# EAGLE design elasticNode (EAGLE 8.4.2)

## Sheet 1 of 4
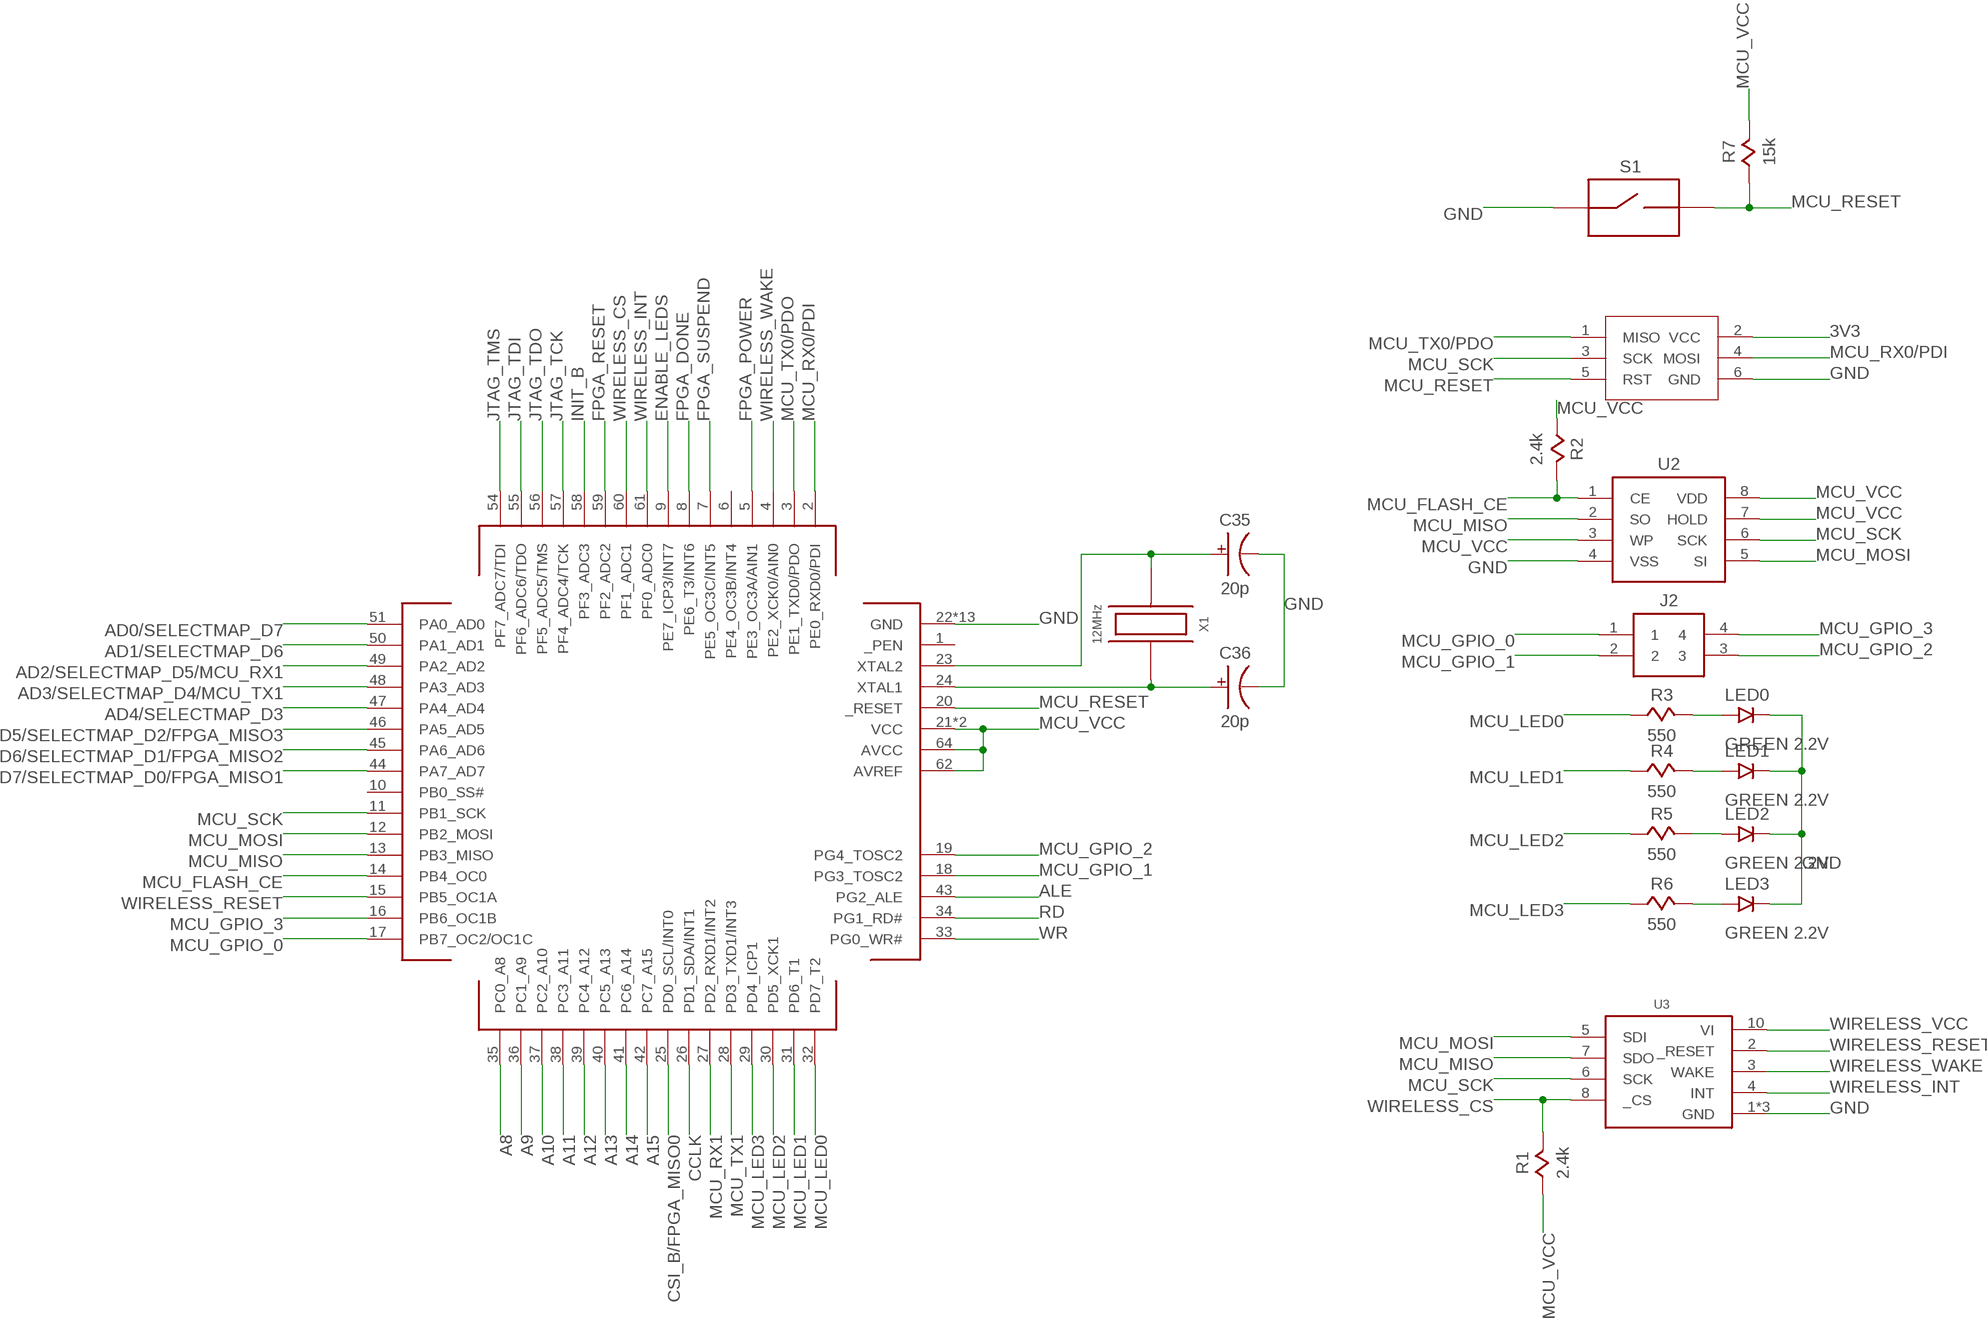
[diagram p0: schematic, sheet 1]

### Parts
C35  20p  CAPACITOR0805  [0805]
C36  20p  CAPACITOR0805  [0805]
J1  ISP_CONN_6PIN  [3X2_HEADER_SMT]
J2  FEMALE_HEADER_2X2  [2X2_HEADER]
LED0  GREEN 2.2V  LED  [0805]
LED1  GREEN 2.2V  LED  [0805]
LED2  GREEN 2.2V  LED  [0805]
LED3  GREEN 2.2V  LED  [0805]
R1  2.4k  RESISTOR  [0805]
R2  2.4k  RESISTOR  [0805]
R3  550  RESISTOR  [0805]
R4  550  RESISTOR  [0805]
R5  550  RESISTOR  [0805]
R6  550  RESISTOR  [0805]
R7  15k  RESISTOR  [0805]
S1  SPST_BUTTON2PIN_SMT  [SPST_2PIN_SMT]
U1  ATMEGA64AQFN  [QFN64]
U2  SST26VF032B  [SOIC8]
U3  MRF24J40MA  [MRF24J40MA]
X1  12MHz  QUARTZ  [3.2X2.5_OSC]

### Nets
3V3 [power]: J1.2(VCC) ; also sheet 3,4
A8: U1.35(PC0_A8) ; also sheet 2
A9: U1.36(PC1_A9) ; also sheet 2
A10: U1.37(PC2_A10) ; also sheet 2
A11: U1.38(PC3_A11) ; also sheet 2
A12: U1.39(PC4_A12) ; also sheet 2
A13: U1.40(PC5_A13) ; also sheet 2
A14: U1.41(PC6_A14) ; also sheet 2
A15: U1.42(PC7_A15) ; also sheet 2
AD0/SELECTMAP_D7: U1.51(PA0_AD0) ; also sheet 2
AD1/SELECTMAP_D6: U1.50(PA1_AD1) ; also sheet 2
AD2/SELECTMAP_D5/MCU_RX1: U1.49(PA2_AD2) ; also sheet 2
AD3/SELECTMAP_D4/MCU_TX1: U1.48(PA3_AD3) ; also sheet 2
AD4/SELECTMAP_D3: U1.47(PA4_AD4) ; also sheet 2
AD5/SELECTMAP_D2/FPGA_MISO3: U1.46(PA5_AD5) ; also sheet 2
AD6/SELECTMAP_D1/FPGA_MISO2: U1.45(PA6_AD6) ; also sheet 2
AD7/SELECTMAP_D0/FPGA_MISO1: U1.44(PA7_AD7) ; also sheet 2
ALE: U1.43(PG2_ALE) ; also sheet 2
CCLK: U1.26(PD1_SDA/INT1) ; also sheet 2
CSI_B/FPGA_MISO0: U1.25(PD0_SCL/INT0) ; also sheet 2
ENABLE_LEDS: U1.9(PE7_ICP3/INT7) ; also sheet 2
FPGA_DONE: U1.8(PE6_T3/INT6) ; also sheet 2
FPGA_POWER: U1.5(PE3_OC3A/AIN1) ; also sheet 2
FPGA_RESET: U1.59(PF2_ADC2) ; also sheet 2
FPGA_SUSPEND: U1.7(PE5_OC3C/INT5) ; also sheet 2
GND: C35.2 C36.2 J1.6(GND) LED0.2 LED1.2 LED2.2 LED3.2 S1.1 U1.22(GND) U1.53(GND) U1.63(GND) U1.PAD(GND) U1.VIA1(GND) U1.VIA2(GND) U1.VIA3(GND) U1.VIA4(GND) U1.VIA5(GND) U1.VIA6(GND) U1.VIA7(GND) U1.VIA8(GND) U1.VIA9(GND) U2.4(VSS) U3.1(GND) U3.11(GND) U3.12(GND) ; also sheet 2,3,4
INIT_B: U1.58(PF3_ADC3) ; also sheet 2
JTAG_TCK: U1.57(PF4_ADC4/TCK) ; also sheet 2
JTAG_TDI: U1.55(PF6_ADC6/TDO) ; also sheet 2
JTAG_TDO: U1.56(PF5_ADC5/TMS) ; also sheet 2
JTAG_TMS: U1.54(PF7_ADC7/TDI) ; also sheet 2
MCU_FLASH_CE: R2.2 U1.14(PB4_OC0) U2.1(CE)
MCU_GPIO_0: J2.1 U1.17(PB7_OC2/OC1C)
MCU_GPIO_1: J2.2 U1.18(PG3_TOSC2)
MCU_GPIO_2: J2.3 U1.19(PG4_TOSC2)
MCU_GPIO_3: J2.4 U1.16(PB6_OC1B)
MCU_LED0: R3.1 U1.32(PD7_T2)
MCU_LED1: R4.1 U1.31(PD6_T1)
MCU_LED2: R5.1 U1.30(PD5_XCK1)
MCU_LED3: R6.1 U1.29(PD4_ICP1)
MCU_MISO: U1.13(PB3_MISO) U2.2(SO) U3.7(SDO)
MCU_MOSI: U1.12(PB2_MOSI) U2.5(SI) U3.5(SDI)
MCU_RESET: J1.5(RST) R7.1 S1.2 U1.20(_RESET)
MCU_RX0/PDI: J1.4(MOSI) U1.2(PE0_RXD0/PDI)
MCU_RX1: U1.27(PD2_RXD1/INT2) ; also sheet 4
MCU_SCK: J1.3(SCK) U1.11(PB1_SCK) U2.6(SCK) U3.6(SCK)
MCU_TX0/PDO: J1.1(MISO) U1.3(PE1_TXD0/PDO)
MCU_TX1: U1.28(PD3_TXD1/INT3) ; also sheet 4
MCU_VCC: R1.1 R2.1 R7.2 U1.21(VCC) U1.52(VCC) U1.62(AVREF) U1.64(AVCC) U2.3(WP) U2.7(HOLD) U2.8(VDD) ; also sheet 3
N$13: LED3.1 R6.2
N$15: LED2.1 R5.2
N$23: LED1.1 R4.2
N$24: LED0.1 R3.2
RD: U1.34(PG1_RD#) ; also sheet 2
WIRELESS_CS: R1.2 U1.60(PF1_ADC1) U3.8(_CS)
WIRELESS_INT: U1.61(PF0_ADC0) U3.4(INT)
WIRELESS_RESET: U1.15(PB5_OC1A) U3.2(_RESET)
WIRELESS_VCC [power]: U3.10(VI) ; also sheet 3
WIRELESS_WAKE: U1.4(PE2_XCK0/AIN0) U3.3(WAKE)
WR: U1.33(PG0_WR#) ; also sheet 2
XTAL1: C36.1 U1.24(XTAL1) X1.1
XTAL2: C35.1 U1.23(XTAL2) X1.3
Unconnected: U1.1(_PEN) U1.6(PE4_OC3B/INT4) U1.10(PB0_SS#)

## Sheet 2 of 4
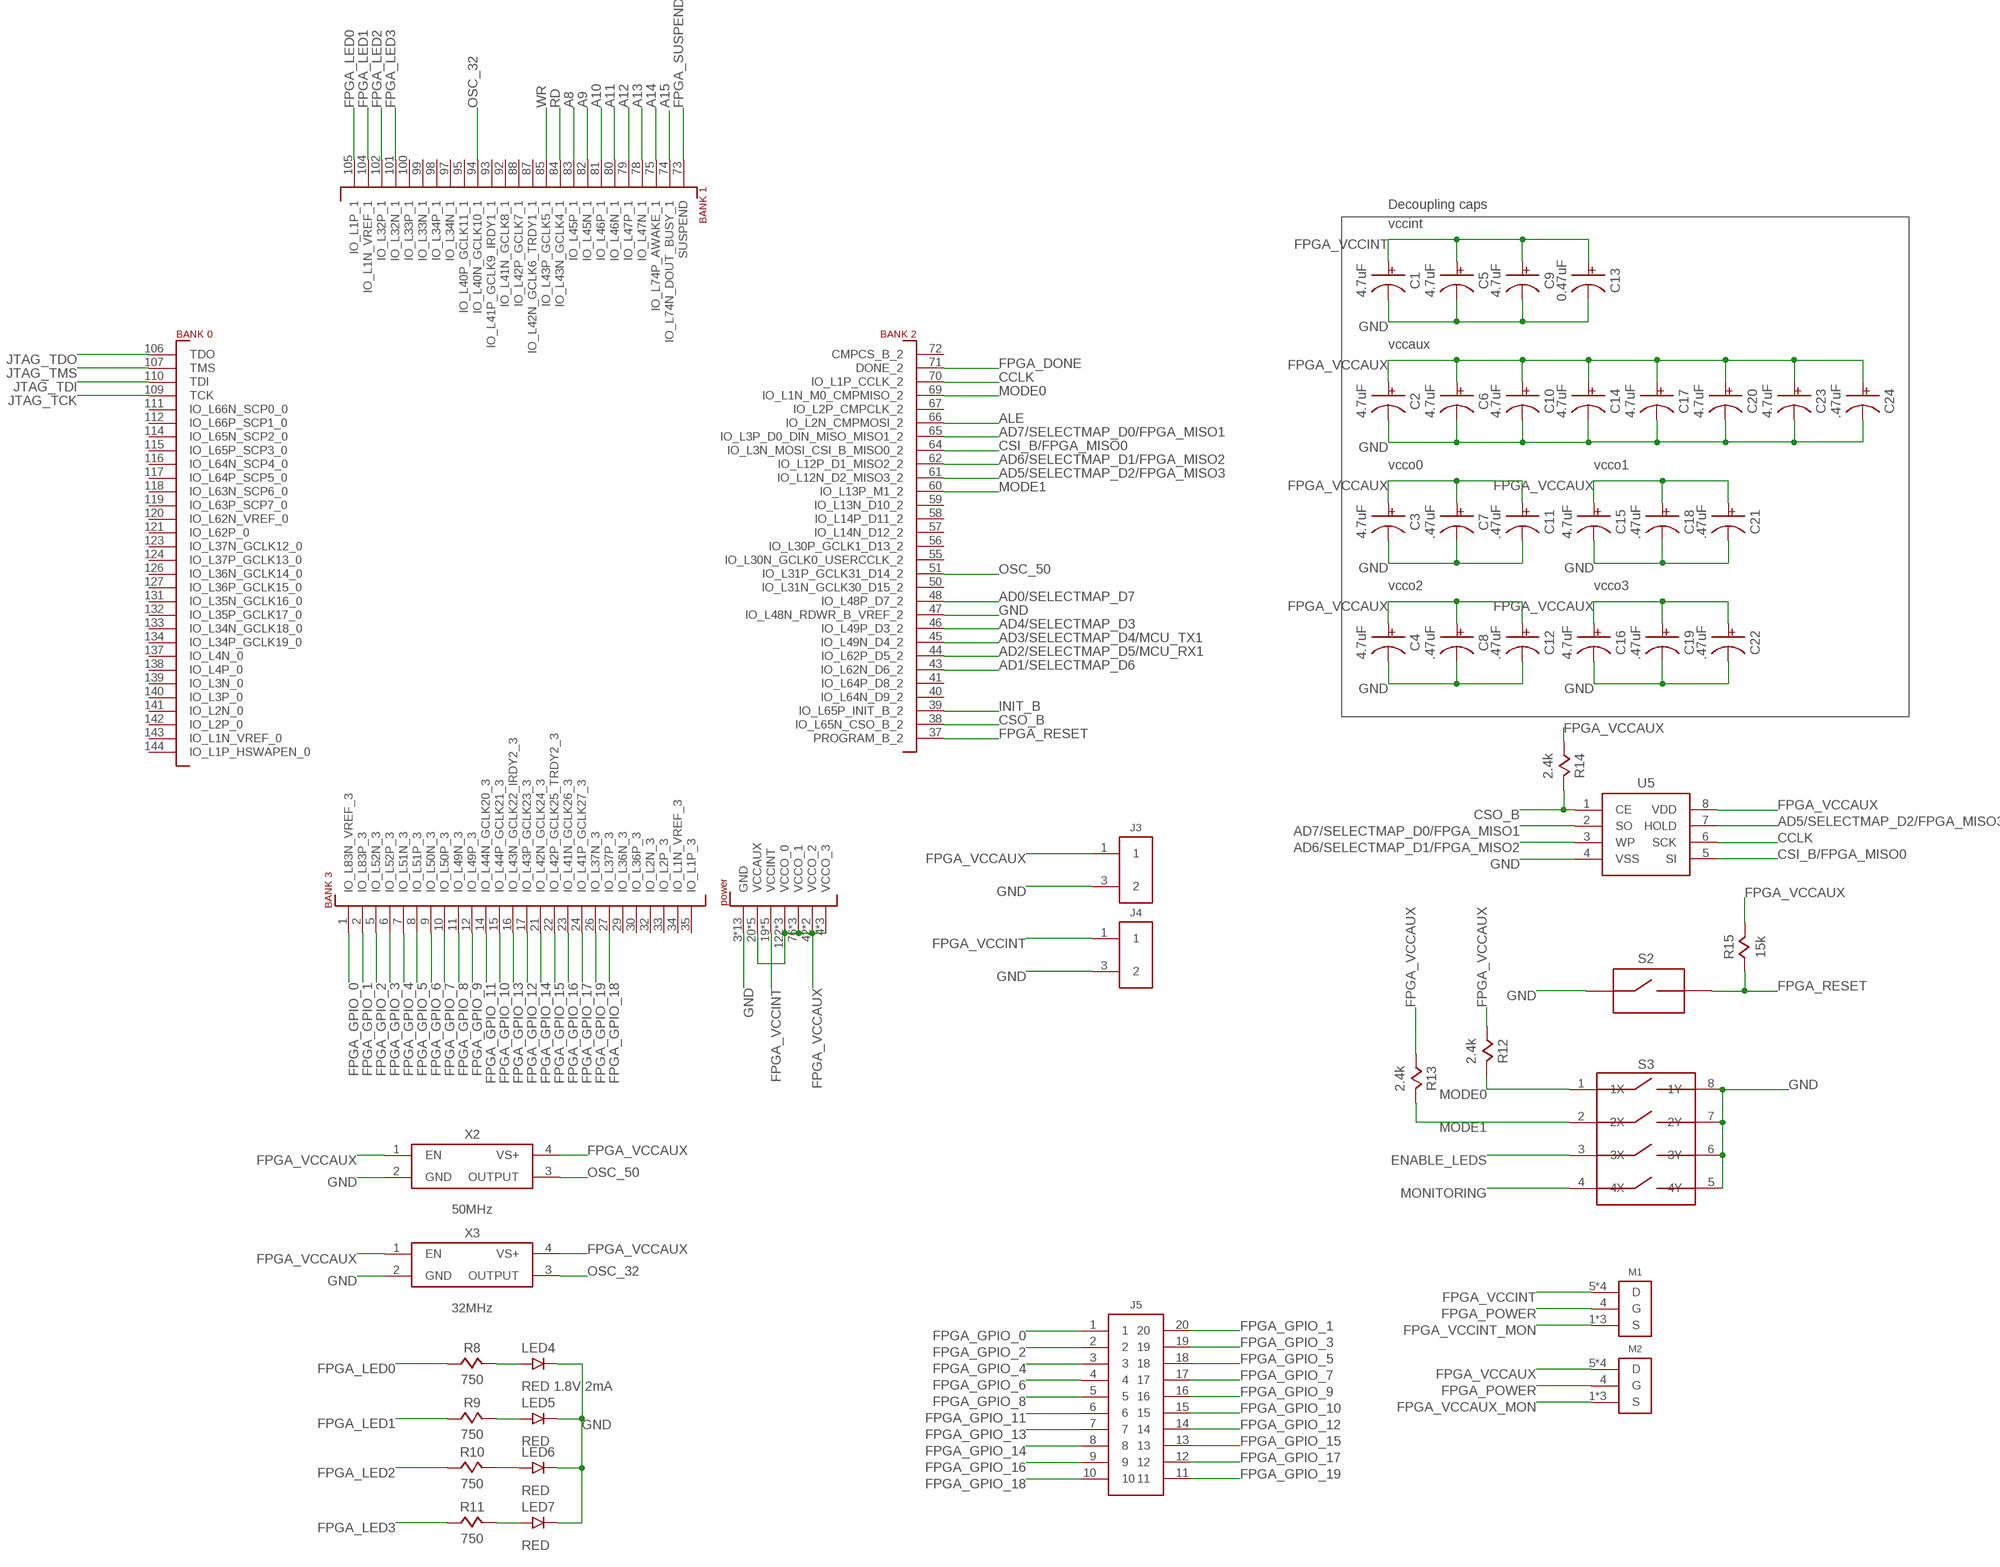
[diagram p1: schematic, sheet 2]

### Parts
C1  4.7uF  CAPACITOR0805  [0805]
C2  4.7uF  CAPACITOR0805  [0805]
C3  4.7uF  CAPACITOR0805  [0805]
C4  4.7uF  CAPACITOR0805  [0805]
C5  4.7uF  CAPACITOR0805  [0805]
C6  4.7uF  CAPACITOR0805  [0805]
C7  .47uF  CAPACITOR0402  [0402]
C8  .47uF  CAPACITOR0402  [0402]
C9  4.7uF  CAPACITOR0805  [0805]
C10  4.7uF  CAPACITOR0805  [0805]
C11  .47uF  CAPACITOR0402  [0402]
C12  .47uF  CAPACITOR0402  [0402]
C13  0.47uF  CAPACITOR0402  [0402]
C14  4.7uF  CAPACITOR0805  [0805]
C15  4.7uF  CAPACITOR0805  [0805]
C16  4.7uF  CAPACITOR0805  [0805]
C17  4.7uF  CAPACITOR0805  [0805]
C18  .47uF  CAPACITOR0402  [0402]
C19  .47uF  CAPACITOR0402  [0402]
C20  4.7uF  CAPACITOR0805  [0805]
C21  .47uF  CAPACITOR0402  [0402]
C22  .47uF  CAPACITOR0402  [0402]
C23  4.7uF  CAPACITOR0805  [0805]
C24  .47uF  CAPACITOR0805  [0805]
J3  FEMALE_HEADER_2X1  [2X1_HEADER]
J4  FEMALE_HEADER_2X1  [2X1_HEADER]
J5  FEMALE_HEADER_10X2  [10X2_HEADER_SMT]
LED4  RED 1.8V 2mA  LED  [0805]
LED5  RED  LED  [0805]
LED6  RED  LED  [0805]
LED7  RED  LED  [0805]
M1  SISS23DN  [POWERPAK1212-8]
M2  SISS23DN  [POWERPAK1212-8]
R8  750  RESISTOR  [0805]
R9  750  RESISTOR  [0805]
R10  750  RESISTOR  [0805]
R11  750  RESISTOR  [0805]
R12  2.4k  RESISTOR  [0805]
R13  2.4k  RESISTOR  [0805]
R14  2.4k  RESISTOR  [0805]
R15  15k  RESISTOR  [0805]
S2  SPST_BUTTON2PIN_SMT  [SPST_2PIN_SMT]
S3  SPST_DIP_4  [SPST_DIP4_SMT]
U4  SPARTAN6-LX9  [TQG144]
U5  SST26VF032B  [SOIC8]
X2  50MHz  OSCILLATOR3.2X2.5  [3.2X2.5_OSC]
X3  32MHz  OSCILLATOR3.2X2.5  [3.2X2.5_OSC]

### Nets
A8: U4.83(IO_L45P_1) ; also sheet 1
A9: U4.82(IO_L45N_1) ; also sheet 1
A10: U4.81(IO_L46P_1) ; also sheet 1
A11: U4.80(IO_L46N_1) ; also sheet 1
A12: U4.79(IO_L47P_1) ; also sheet 1
A13: U4.78(IO_L47N_1) ; also sheet 1
A14: U4.75(IO_L74P_AWAKE_1) ; also sheet 1
A15: U4.74(IO_L74N_DOUT_BUSY_1) ; also sheet 1
AD0/SELECTMAP_D7: U4.48(IO_L48P_D7_2) ; also sheet 1
AD1/SELECTMAP_D6: U4.43(IO_L62N_D6_2) ; also sheet 1
AD2/SELECTMAP_D5/MCU_RX1: U4.44(IO_L62P_D5_2) ; also sheet 1
AD3/SELECTMAP_D4/MCU_TX1: U4.45(IO_L49N_D4_2) ; also sheet 1
AD4/SELECTMAP_D3: U4.46(IO_L49P_D3_2) ; also sheet 1
AD5/SELECTMAP_D2/FPGA_MISO3: U4.61(IO_L12N_D2_MISO3_2) U5.7(HOLD) ; also sheet 1
AD6/SELECTMAP_D1/FPGA_MISO2: U4.62(IO_L12P_D1_MISO2_2) U5.3(WP) ; also sheet 1
AD7/SELECTMAP_D0/FPGA_MISO1: U4.65(IO_L3P_D0_DIN_MISO_MISO1_2) U5.2(SO) ; also sheet 1
ALE: U4.66(IO_L2N_CMPMOSI_2) ; also sheet 1
CCLK: U4.70(IO_L1P_CCLK_2) U5.6(SCK) ; also sheet 1
CSI_B/FPGA_MISO0: U4.64(IO_L3N_MOSI_CSI_B_MISO0_2) U5.5(SI) ; also sheet 1
CSO_B: R14.2 U4.38(IO_L65N_CSO_B_2) U5.1(CE)
ENABLE_LEDS: S3.3(3X) ; also sheet 1
FPGA_DONE: U4.71(DONE_2) ; also sheet 1
FPGA_GPIO_0: J5.1 U4.1(IO_L83N_VREF_3)
FPGA_GPIO_1: J5.20 U4.2(IO_L83P_3)
FPGA_GPIO_2: J5.2 U4.5(IO_L52N_3)
FPGA_GPIO_3: J5.19 U4.6(IO_L52P_3)
FPGA_GPIO_4: J5.3 U4.7(IO_L51N_3)
FPGA_GPIO_5: J5.18 U4.8(IO_L51P_3)
FPGA_GPIO_6: J5.4 U4.9(IO_L50N_3)
FPGA_GPIO_7: J5.17 U4.10(IO_L50P_3)
FPGA_GPIO_8: J5.5 U4.11(IO_L49N_3)
FPGA_GPIO_9: J5.16 U4.12(IO_L49P_3)
FPGA_GPIO_10: J5.15 U4.15(IO_L44P_GCLK21_3)
FPGA_GPIO_11: J5.6 U4.14(IO_L44N_GCLK20_3)
FPGA_GPIO_12: J5.14 U4.17(IO_L43P_GCLK23_3)
FPGA_GPIO_13: J5.7 U4.16(IO_L43N_GCLK22_IRDY2_3)
FPGA_GPIO_14: J5.8 U4.21(IO_L42N_GCLK24_3)
FPGA_GPIO_15: J5.13 U4.22(IO_L42P_GCLK25_TRDY2_3)
FPGA_GPIO_16: J5.9 U4.23(IO_L41N_GCLK26_3)
FPGA_GPIO_17: J5.12 U4.24(IO_L41P_GCLK27_3)
FPGA_GPIO_18: J5.10 U4.27(IO_L37P_3)
FPGA_GPIO_19: J5.11 U4.26(IO_L37N_3)
FPGA_LED0: R8.1 U4.105(IO_L1P_1)
FPGA_LED1: R9.1 U4.104(IO_L1N_VREF_1)
FPGA_LED2: R10.1 U4.102(IO_L32P_1)
FPGA_LED3: R11.1 U4.101(IO_L32N_1)
FPGA_POWER: M1.4(G) M2.4(G) ; also sheet 1
FPGA_RESET: R15.1 S2.2 U4.37(PROGRAM_B_2) ; also sheet 1
FPGA_SUSPEND: U4.73(SUSPEND) ; also sheet 1
FPGA_VCCAUX [power]: C2.1 C3.1 C4.1 C6.1 C7.1 C8.1 C10.1 C11.1 C12.1 C14.1 C15.1 C16.1 C17.1 C18.1 C19.1 C20.1 C21.1 C22.1 C23.1 C24.1 J3.1 M2.5(D) M2.6(D) M2.7(D) M2.8(D) R12.1 R13.1 R14.1 R15.2 U4.4(VCCO_3) U4.18(VCCO_3) U4.20(VCCAUX) U4.31(VCCO_3) U4.36(VCCAUX) U4.42(VCCO_2) U4.53(VCCAUX) U4.63(VCCO_2) U4.76(VCCO_1) U4.86(VCCO_1) U4.90(VCCAUX) U4.103(VCCO_1) U4.122(VCCO_0) U4.125(VCCO_0) U4.129(VCCAUX) U4.135(VCCO_0) U5.8(VDD) X2.1(EN) X2.4(VS+) X3.1(EN) X3.4(VS+)
FPGA_VCCAUX_MON: M2.1(S) M2.2(S) M2.3(S) ; also sheet 3
FPGA_VCCINT [power]: C1.1 C5.1 C9.1 C13.1 J4.1 M1.5(D) M1.6(D) M1.7(D) M1.8(D) U4.19(VCCINT) U4.28(VCCINT) U4.52(VCCINT) U4.89(VCCINT) U4.128(VCCINT)
FPGA_VCCINT_MON [power]: M1.1(S) M1.2(S) M1.3(S) ; also sheet 3
GND: C1.2 C2.2 C3.2 C4.2 C5.2 C6.2 C7.2 C8.2 C9.2 C10.2 C11.2 C12.2 C13.2 C14.2 C15.2 C16.2 C17.2 C18.2 C19.2 C20.2 C21.2 C22.2 C23.2 C24.2 J3.3 J4.3 LED4.2 LED5.2 LED6.2 LED7.2 S2.1 S3.5(4Y) S3.6(3Y) S3.7(2Y) S3.8(1Y) U4.3(GND) U4.13(GND) U4.25(GND) U4.47(IO_L48N_RDWR_B_VREF_2) U4.49(GND) U4.54(GND) U4.68(GND) U4.77(GND) U4.91(GND) U4.96(GND) U4.108(GND) U4.113(GND) U4.130(GND) U4.136(GND) U5.4(VSS) X2.2(GND) X3.2(GND) ; also sheet 1,3,4
INIT_B: U4.39(IO_L65P_INIT_B_2) ; also sheet 1
JTAG_TCK: U4.109(TCK) ; also sheet 1
JTAG_TDI: U4.110(TDI) ; also sheet 1
JTAG_TDO: U4.106(TDO) ; also sheet 1
JTAG_TMS: U4.107(TMS) ; also sheet 1
MODE0: R12.2 S3.1(1X) U4.69(IO_L1N_M0_CMPMISO_2)
MODE1: R13.2 S3.2(2X) U4.60(IO_L13P_M1_2)
MONITORING: S3.4(4X) ; also sheet 3
N$25: LED7.1 R11.2
N$27: LED6.1 R10.2
N$29: LED5.1 R9.2
N$30: LED4.1 R8.2
OSC_32: U4.94(IO_L40N_GCLK10_1) X3.3(OUTPUT)
OSC_50: U4.51(IO_L31P_GCLK31_D14_2) X2.3(OUTPUT)
RD: U4.84(IO_L43N_GCLK4_1) ; also sheet 1
WR: U4.85(IO_L43P_GCLK5_1) ; also sheet 1
Unconnected: U4.29(IO_L36N_3) U4.30(IO_L36P_3) U4.32(IO_L2N_3) U4.33(IO_L2P_3) U4.34(IO_L1N_VREF_3) U4.35(IO_L1P_3) U4.40(IO_L64N_D9_2) U4.41(IO_L64P_D8_2) U4.50(IO_L31N_GCLK30_D15_2) U4.55(IO_L30N_GCLK0_USERCCLK_2) U4.56(IO_L30P_GCLK1_D13_2) U4.57(IO_L14N_D12_2) U4.58(IO_L14P_D11_2) U4.59(IO_L13N_D10_2) U4.67(IO_L2P_CMPCLK_2) U4.72(CMPCS_B_2) U4.87(IO_L42N_GCLK6_TRDY1_1) U4.88(IO_L42P_GCLK7_1) U4.92(IO_L41N_GCLK8_1) U4.93(IO_L41P_GCLK9_IRDY1_1) U4.95(IO_L40P_GCLK11_1) U4.97(IO_L34N_1) U4.98(IO_L34P_1) U4.99(IO_L33N_1) U4.100(IO_L33P_1) U4.111(IO_L66N_SCP0_0) U4.112(IO_L66P_SCP1_0) U4.114(IO_L65N_SCP2_0) U4.115(IO_L65P_SCP3_0) U4.116(IO_L64N_SCP4_0) U4.117(IO_L64P_SCP5_0) U4.118(IO_L63N_SCP6_0) U4.119(IO_L63P_SCP7_0) U4.120(IO_L62N_VREF_0) U4.121(IO_L62P_0) U4.123(IO_L37N_GCLK12_0) U4.124(IO_L37P_GCLK13_0) U4.126(IO_L36N_GCLK14_0) U4.127(IO_L36P_GCLK15_0) U4.131(IO_L35N_GCLK16_0) U4.132(IO_L35P_GCLK17_0) U4.133(IO_L34N_GCLK18_0) U4.134(IO_L34P_GCLK19_0) U4.137(IO_L4N_0) U4.138(IO_L4P_0) U4.139(IO_L3N_0) U4.140(IO_L3P_0) U4.141(IO_L2N_0) U4.142(IO_L2P_0) U4.143(IO_L1N_VREF_0) U4.144(IO_L1P_HSWAPEN_0)

### Notes on the sheet
- Decoupling caps
- vccint
- vccaux
- vcco0 | vcco1
- vcco2 | vcco3

## Sheet 3 of 4
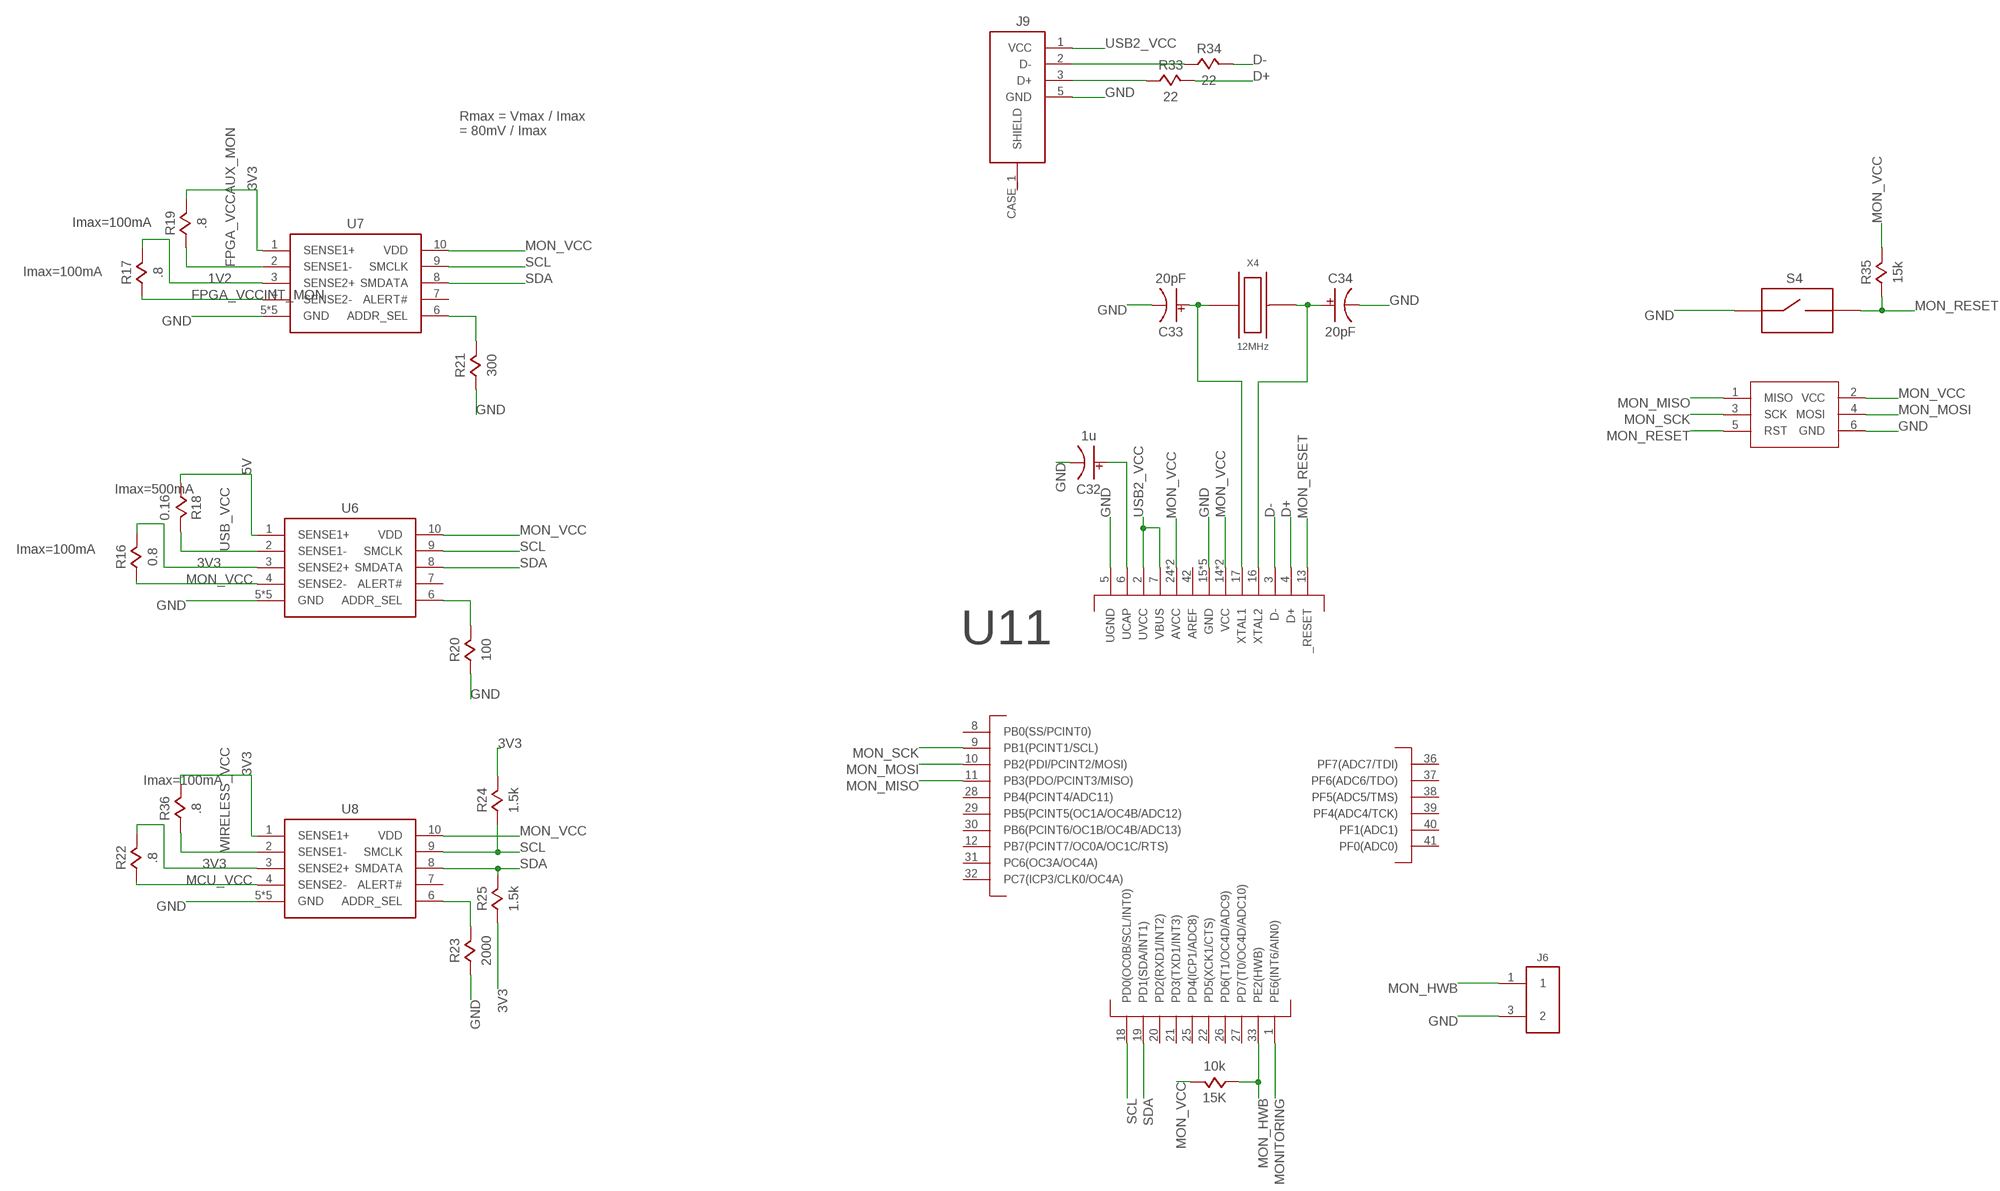
[diagram p2: schematic, sheet 3]

### Parts
15K  10k  RESISTOR  [0805]
C32  1u  CAPACITOR0805  [0805]
C33  20pF  CAPACITOR0805  [0805]
C34  20pF  CAPACITOR0805  [0805]
J6  FEMALE_HEADER_2X1  [2X1_HEADER]
J9  USB_CONNSMT  [USB_MICRO_B_SMT]
J10  ISP_CONN_6PIN  [3X2_HEADER_SMT]
R16  0.8  RESISTOR  [0805]
R17  .8  RESISTOR  [0805]
R18  0.16  RESISTOR  [0805]
R19  .8  RESISTOR  [0805]
R20  100  RESISTOR  [0805]
R21  300  RESISTOR  [0805]
R22  .8  RESISTOR  [0805]
R23  2000  RESISTOR  [0805]
R24  1.5k  RESISTOR  [0805]
R25  1.5k  RESISTOR  [0805]
R33  22  RESISTOR  [0805]
R34  22  RESISTOR  [0805]
R35  15k  RESISTOR  [0805]
R36  .8  RESISTOR  [0805]
S4  SPST_BUTTON2PIN_SMT  [SPST_2PIN_SMT]
U6  PAC1720  [VDFN10]
U7  PAC1720  [VDFN10]
U8  PAC1720  [VDFN10]
U11  ATMEGA32U4  [QFN44]
X4  12MHz  QUARTZ  [3.2X2.5_OSC]

### Nets
1V2 [power]: R17.2 U7.3(SENSE2+) ; also sheet 4
3V3 [power]: R16.2 R19.2 R22.2 R24.2 R25.1 R36.1 U6.3(SENSE2+) U7.1(SENSE1+) U8.1(SENSE1+) U8.3(SENSE2+) ; also sheet 1,4
5V [power]: R18.1 U6.1(SENSE1+) ; also sheet 4
D+: R33.2 U11.4(D+)
D-: R34.2 U11.3(D-)
FPGA_VCCAUX_MON: R19.1 U7.2(SENSE1-) ; also sheet 2
FPGA_VCCINT_MON [power]: R17.1 U7.4(SENSE2-) ; also sheet 2
GND: C32.2 C33.2 C34.2 J6.3 J9.5(GND) J10.6(GND) R20.1 R21.1 R23.1 S4.1 U6.5(GND) U6.P$1(GND) U6.P$2(GND) U6.P$3(GND) U6.P$4(GND) U7.5(GND) U7.P$1(GND) U7.P$2(GND) U7.P$3(GND) U7.P$4(GND) U8.5(GND) U8.P$1(GND) U8.P$2(GND) U8.P$3(GND) U8.P$4(GND) U11.5(UGND) U11.15(GND) U11.23(GND) U11.35(GND) U11.43(GND) U11.45(GND) ; also sheet 1,2,4
MCU_VCC: R22.1 U8.4(SENSE2-) ; also sheet 1
MON_HWB: 15K.1 J6.1 U11.33(PE2(HWB))
MON_MISO: J10.1(MISO) U11.11(PB3(PDO/PCINT3/MISO))
MON_MOSI: J10.4(MOSI) U11.10(PB2(PDI/PCINT2/MOSI))
MON_RESET: J10.5(RST) R35.1 S4.2 U11.13(_RESET)
MON_SCK: J10.3(SCK) U11.9(PB1(PCINT1/SCL))
MON_VCC [power]: 15K.2 J10.2(VCC) R16.1 R35.2 U6.4(SENSE2-) U6.10(VDD) U7.10(VDD) U8.10(VDD) U11.14(VCC) U11.24(AVCC) U11.34(VCC) U11.44(AVCC)
MON_XTAL1: C33.1 U11.17(XTAL1) X4.1
MON_XTAL2: C34.1 U11.16(XTAL2) X4.3
MONITORING: U11.1(PE6(INT6/AIN0)) ; also sheet 2
N$16: R23.2 U8.6(ADDR_SEL)
N$28: R21.2 U7.6(ADDR_SEL)
N$32: R20.2 U6.6(ADDR_SEL)
N$38: J9.3(D+) R33.1
N$39: J9.2(D-) R34.1
SCL: R24.1 U6.9(SMCLK) U7.9(SMCLK) U8.9(SMCLK) U11.18(PD0(OC0B/SCL/INT0))
SDA: R25.2 U6.8(SMDATA) U7.8(SMDATA) U8.8(SMDATA) U11.19(PD1(SDA/INT1))
UCAP: C32.1 U11.6(UCAP)
USB2_VCC [power]: J9.1(VCC) U11.2(UVCC) U11.7(VBUS)
USB_VCC: R18.2 U6.2(SENSE1-) ; also sheet 4
WIRELESS_VCC [power]: R36.2 U8.2(SENSE1-) ; also sheet 1
Unconnected: J9.CASE_1(SHIELD) U6.7(ALERT#) U7.7(ALERT#) U8.7(ALERT#) U11.8(PB0(SS/PCINT0)) U11.12(PB7(PCINT7/OC0A/OC1C/RTS)) U11.20(PD2(RXD1/INT2)) U11.21(PD3(TXD1/INT3)) U11.22(PD5(XCK1/CTS)) U11.25(PD4(ICP1/ADC8)) U11.26(PD6(T1/OC4D/ADC9)) U11.27(PD7(T0/OC4D/ADC10)) U11.28(PB4(PCINT4/ADC11)) U11.29(PB5(PCINT5(OC1A/OC4B/ADC12)) U11.30(PB6(PCINT6/OC1B/OC4B/ADC13)) U11.31(PC6(OC3A/OC4A)) U11.32(PC7(ICP3/CLK0/OC4A)) U11.36(PF7(ADC7/TDI)) U11.37(PF6(ADC6/TDO)) U11.38(PF5(ADC5/TMS)) U11.39(PF4(ADC4/TCK)) U11.40(PF1(ADC1)) U11.41(PF0(ADC0)) U11.42(AREF)

### Notes on the sheet
- Rmax = Vmax / Imax
  = 80mV / Imax
- Imax=100mA
- Imax=100mA
- Imax=500mA
- Imax=100mA
- Imax=100mA

## Sheet 4 of 4
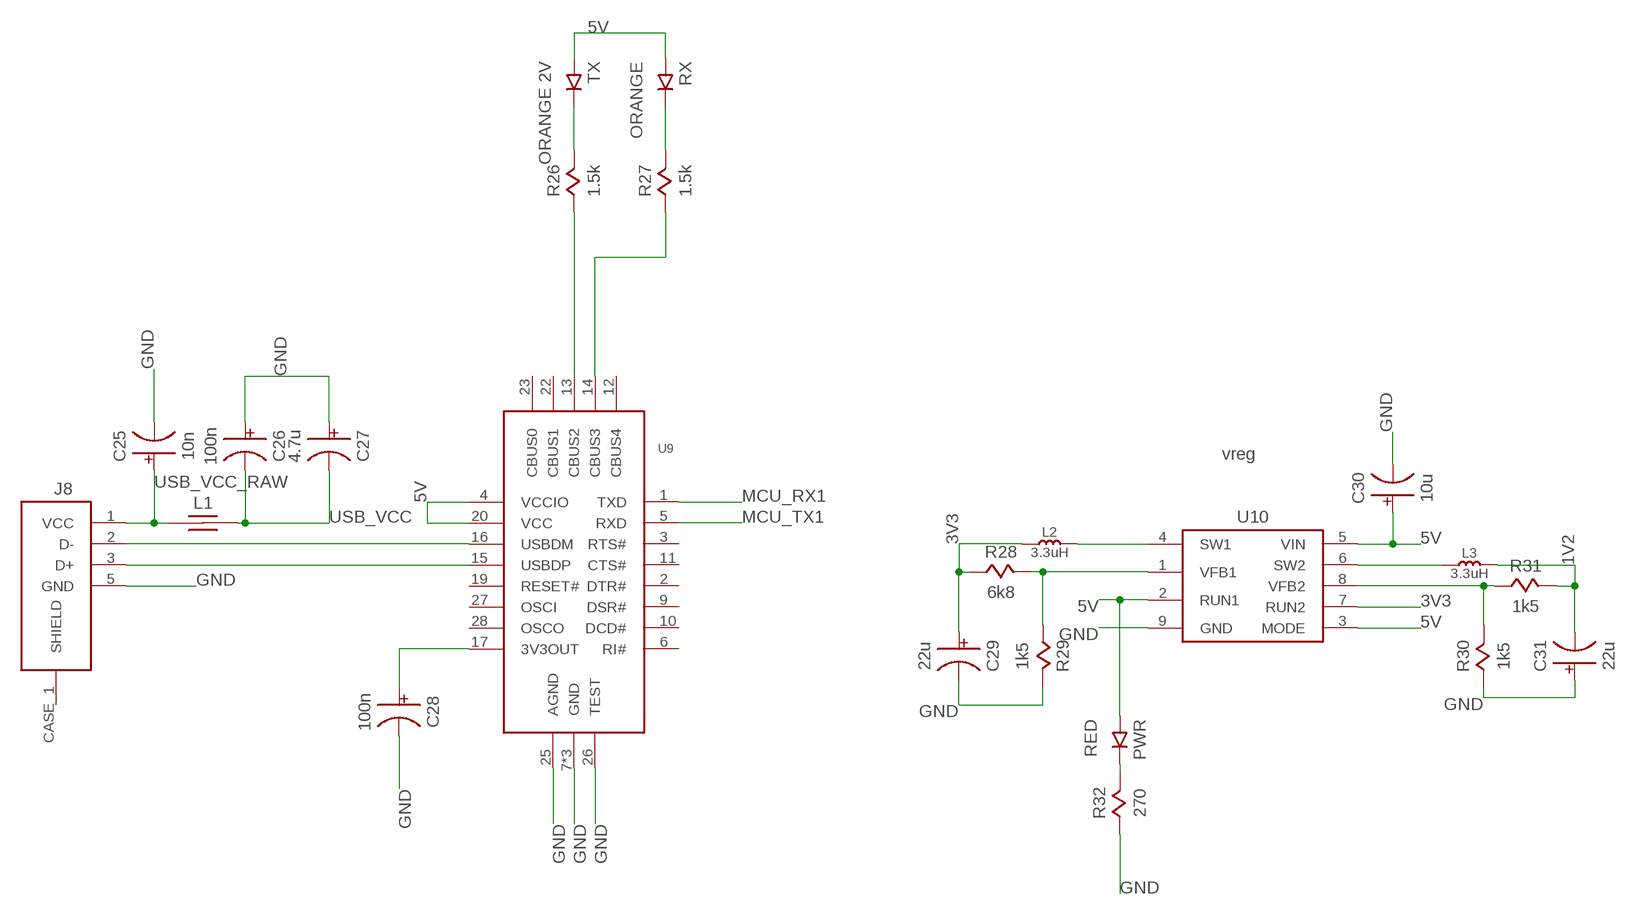
[diagram p3: schematic, sheet 4]

### Parts
C25  10n  CAPACITOR0805  [0805]
C26  100n  CAPACITOR0805  [0805]
C27  4.7u  CAPACITOR0805  [0805]
C28  100n  CAPACITOR0805  [0805]
C29  22u  CAPACITOR0805  [0805]
C30  10u  CAPACITOR0805  [0805]
C31  22u  CAPACITOR0805  [0805]
J8  USB_CONNSMT  [USB_MICRO_B_SMT]
L1  40Ohm 1.5A  FERRITE_BEAD  [0805]
L2  3.3uH  INDUCTOR  [0805]
L3  3.3uH  INDUCTOR  [0805]
PWR  RED  LED  [0805]
R26  1.5k  RESISTOR  [0805]
R27  1.5k  RESISTOR  [0805]
R28  6k8  RESISTOR  [0805]
R29  1k5  RESISTOR  [0805]
R30  1k5  RESISTOR  [0805]
R31  1k5  RESISTOR  [0805]
R32  270  RESISTOR  [0805]
RX  ORANGE  LED  [0805]
TX  ORANGE 2V  LED  [0805]
U9  FT232RSSOP28  [SSOP28]
U10  LTC3419DFN  [DFN8]

### Nets
1V2 [power]: C31.2 L3.2 R31.2 ; also sheet 3
3V3 [power]: C29.1 L2.1 R28.1 U10.7(RUN2) ; also sheet 1,3
5V [power]: C30.1 PWR.1 RX.1 TX.1 U9.4(VCCIO) U9.20(VCC) U10.2(RUN1) U10.3(MODE) U10.5(VIN) ; also sheet 3
FTDI_RXLED: R27.1 U9.14(CBUS3)
GND: C25.2 C26.1 C27.1 C28.2 C29.2 C30.2 C31.1 J8.5(GND) R29.2 R30.1 R32.1 U9.7(GND) U9.18(GND) U9.21(GND) U9.25(AGND) U9.26(TEST) U10.9(GND) ; also sheet 1,2,3
MCU_RX1: U9.1(TXD) ; also sheet 1
MCU_TX1: U9.5(RXD) ; also sheet 1
N$1: L2.2 U10.4(SW1)
N$2: R28.2 R29.1 U10.1(VFB1)
N$3: C28.1 U9.17(3V3OUT)
N$7: R30.2 R31.1 U10.8(VFB2)
N$8: L3.1 U10.6(SW2)
N$10: R26.1 U9.13(CBUS2)
N$11: R26.2 TX.2
N$14: R27.2 RX.2
N$41: PWR.2 R32.2
USB_VCC: C26.2 C27.2 L1.2 ; also sheet 3
USB_VCC_RAW: C25.1 J8.1(VCC) L1.1
USBD+: J8.3(D+) U9.15(USBDP)
USBD-: J8.2(D-) U9.16(USBDM)
Unconnected: J8.CASE_1(SHIELD) U9.2(DTR#) U9.3(RTS#) U9.6(RI#) U9.9(DSR#) U9.10(DCD#) U9.11(CTS#) U9.12(CBUS4) U9.19(RESET#) U9.22(CBUS1) U9.23(CBUS0) U9.27(OSCI) U9.28(OSCO)

### Notes on the sheet
- vreg

## Library data of the parts
15K R1-R36 = passive:RESISTOR
C1-C36 = passive:CAPACITOR
J1 = connectors:ISP_CONN_6PIN; SPICEPREFIX: X
J2 = connectors:FEMALE_HEADER_2X2
J3 J4 J6 = connectors:FEMALE_HEADER_2X1
J5 = connectors:FEMALE_HEADER_10X2
J8 J9 = connectors:USB_CONN
J10 = connectors:ISP_CONN_6PIN
L1 = passive:FERRITE_BEAD
L2 L3 = passive:INDUCTOR
LED0 LED1-LED7 PWR RX TX = opto:LED
M1 M2 = power:SISS23DN
S1 S2 S4 = connectors:SPST_BUTTON
S3 = connectors:SPST_DIP_4
U1 = ic:ATMEGA64A
U2 U5 = ic:SST26VF032B
U3 = wireless:MRF24J40MA
U4 = fpga:SPARTAN6-LX9
U6-U8 = sensors:PAC1720
U9 = ic:FT232R
U10 = power:LTC3419
U11 = ic:ATMEGA32U4
X1 X4 = passive:QUARTZ
X2 X3 = passive:OSCILLATOR

## Board
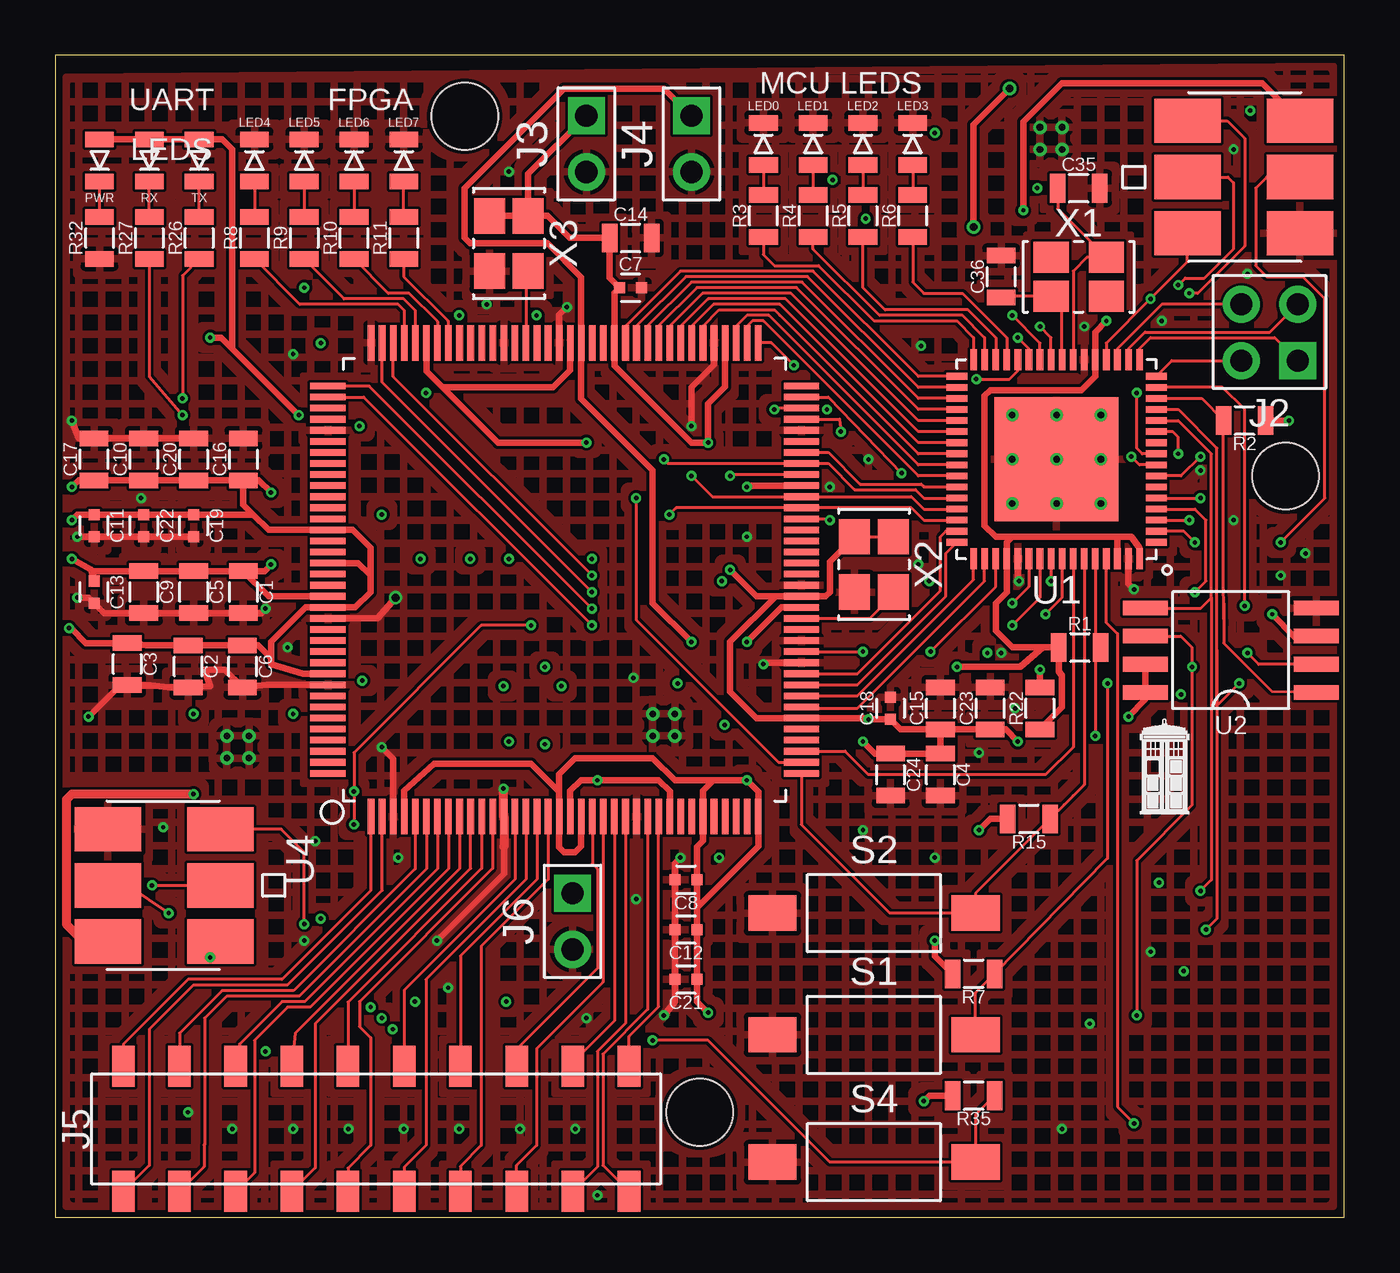
[diagram p4: board, top side]
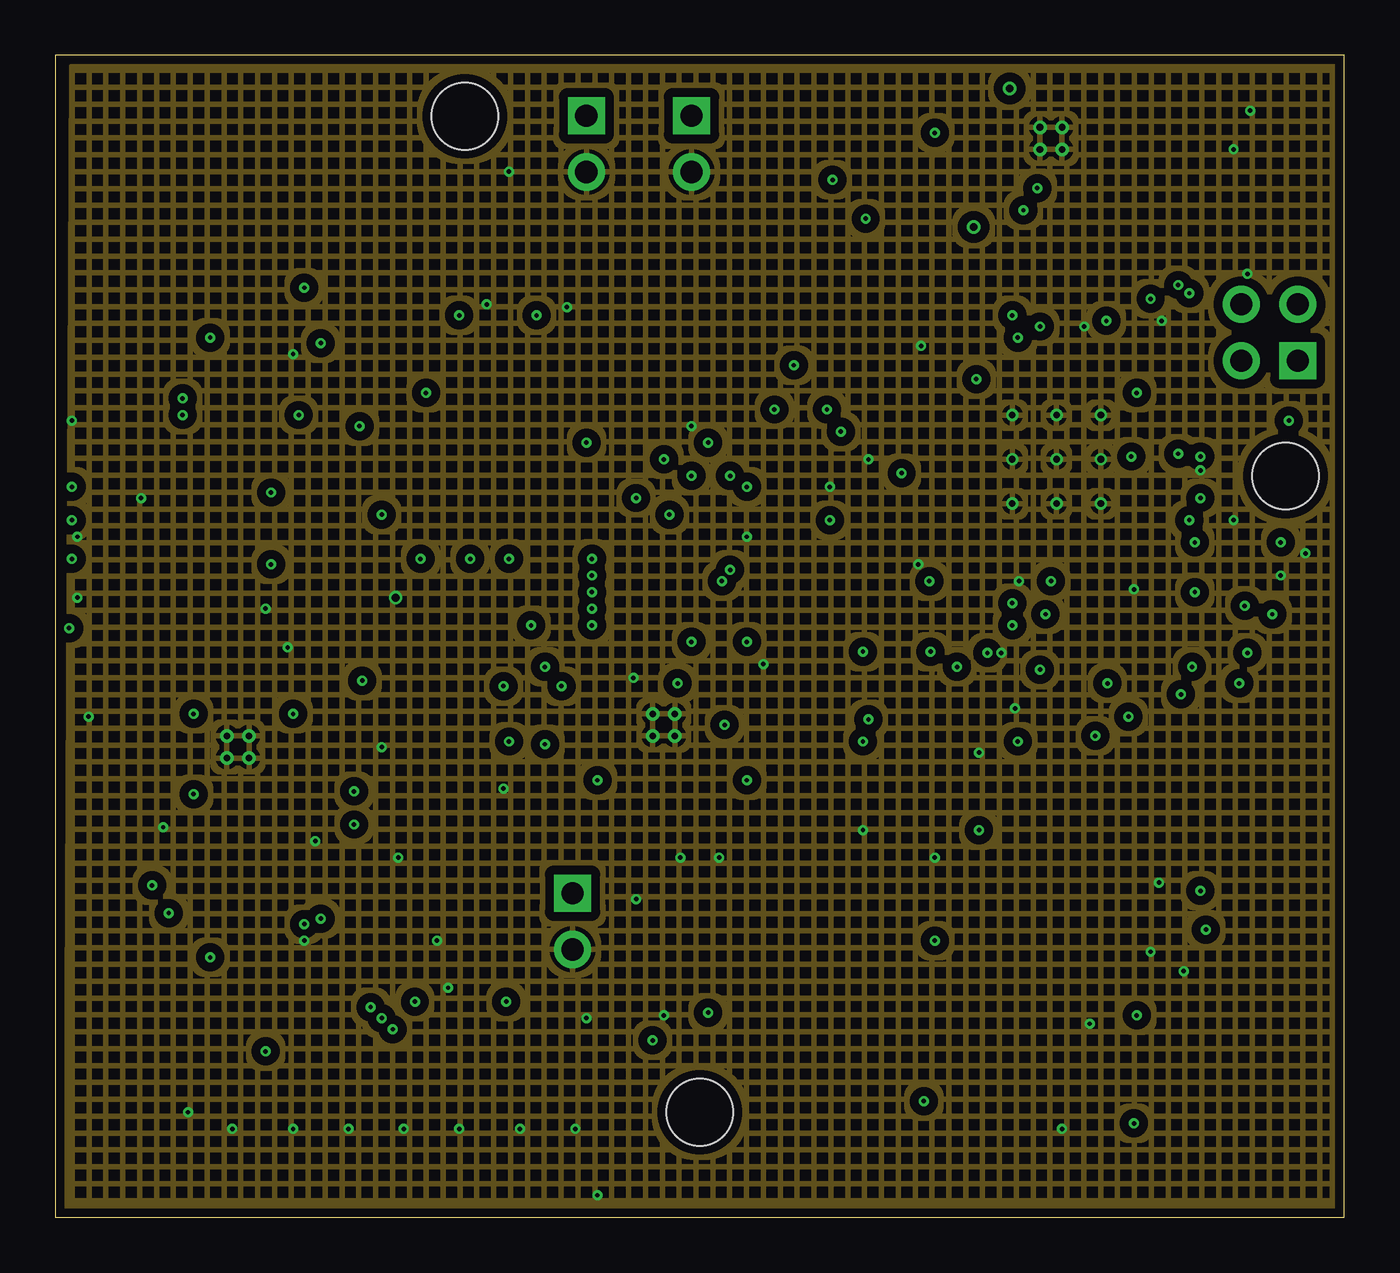
[diagram p5: board, inner layer GroundPlane]
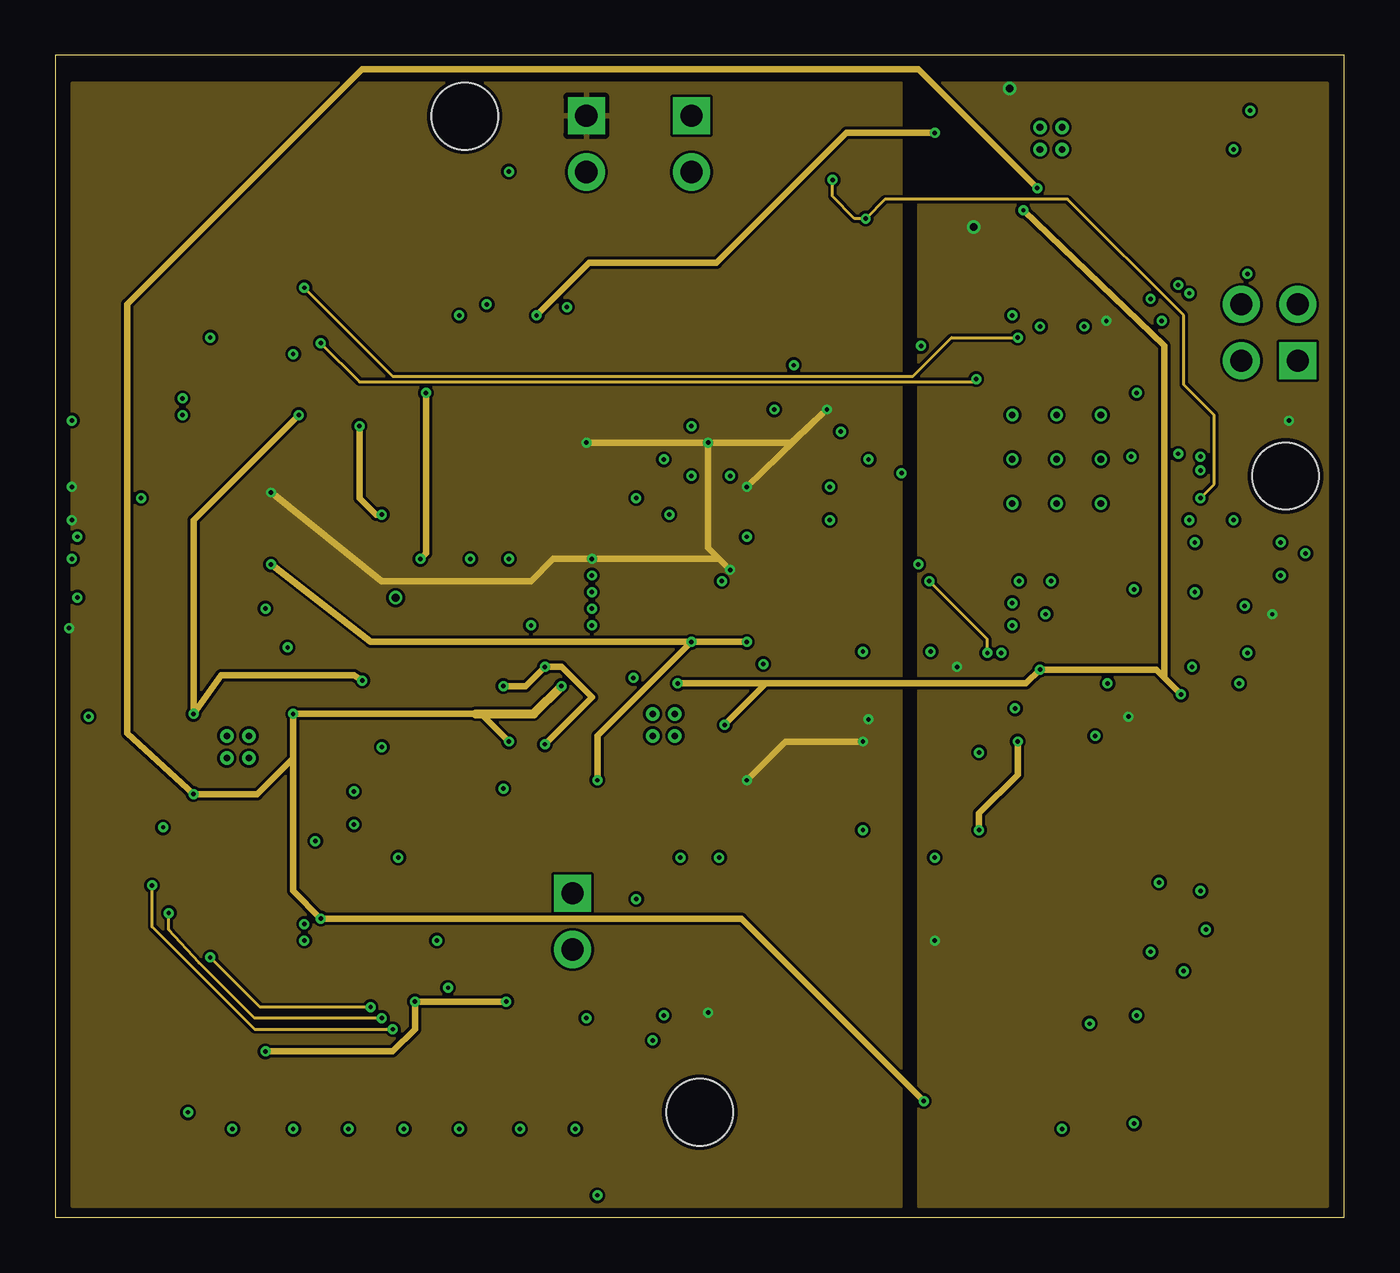
[diagram p6: board, inner layer PowerPlane]
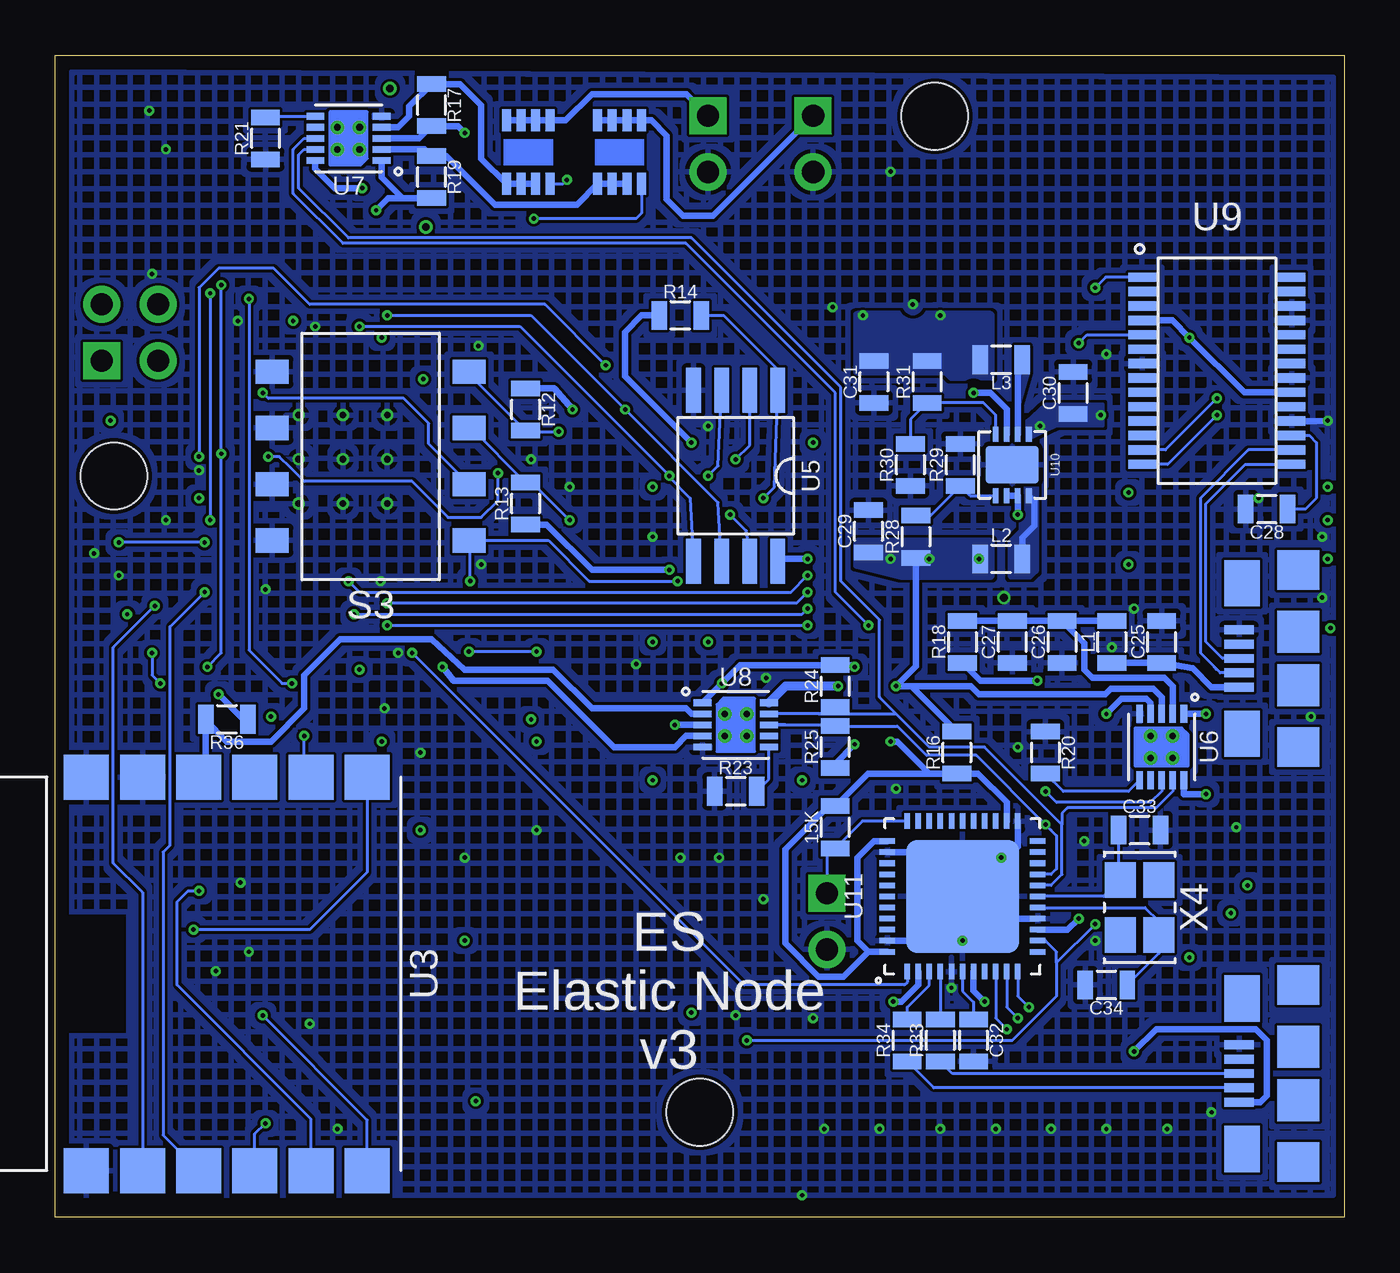
[diagram p7: board, bottom side, seen from below]

Size 58.25 x 52.5 mm. Coordinates in mm from the lower left corner, seen from the top.
Outline: 0,0 58.25,0 58.25,52.5 0,52.5 0,0
Copper layers (1+2*3+16): Top 0.018mm / dielectric 0.36mm / GroundPlane 0.035mm / dielectric 0.71mm / PowerPlane 0.035mm / dielectric 0.36mm / Bottom 0.018mm
Design rules "Multi-CB_4L_125um-Tracks_OL35um-IL35um": minimum track width 0.125mm, minimum drill 0.2mm, track to track 0.125mm, track to pad 0.125mm, pad to pad 0.125mm, via to via 0.125mm, smd to smd 0mil, copper to edge 0.2mm, drill to drill 0.2mm, minimum pad ring 0.125mm, minimum via ring 0.125mm, stop-mask expansion 2mil, vias tented up to drill 0.45mm, thermal gap 0.2mm
Holes 3 mm at 55.6,33.5 29.12,4.75 18.5,49.75

### Footprints (pad centres in the part's own frame; a part is rotated, then mirrored left to right if it is on the bottom)
0805 = smd 0.7 x 1.3: 1 -0.95,0; 2 0.95,0
0402 = smd 0.5 x 0.5: 1 -0.5,0; 2 0.5,0
3X2_HEADER_SMT = smd 2 x 3: 1 -2.54,-2.58; 2 -2.54,2.5; 3 0,-2.58; 4 0,2.5; 5 2.54,-2.58; 6 2.54,2.5
2X2_HEADER = drill 1 pad 1.676 square: 1 -1.27,1.29 | drill 1 pad 1.676: 2 -1.27,-1.25; 3 1.27,-1.25; 4 1.27,1.29
2X1_HEADER = drill 1 pad 1.676 square: 1 0,1.27 | drill 1 pad 1.676: 3 0,-1.27
10X2_HEADER_SMT = smd 1.85 x 1.02: 1 2.825,11.43; 2 2.825,8.89; 3 2.825,6.35; 4 2.825,3.81; 5 2.825,1.27; 6 2.825,-1.27; 7 2.825,-3.81; 8 2.825,-6.35; 9 2.825,-8.89; 10 2.825,-11.43; 11 -2.825,-11.43; 12 -2.825,-8.89; 13 -2.825,-6.35; 14 -2.825,-3.81; 15 -2.825,-1.27; 16 -2.825,1.27; 17 -2.825,3.81; 18 -2.825,6.35; 19 -2.825,8.89; 20 -2.825,11.43
USB_MICRO_B_SMT = smd 0.4 x 1.35: 1 -1.3,0; 2 -0.65,0; 3 0,0; 4 0.65,0; 5 1.3,0 | smd 2.1 x 1.6: CASE_1 -3.4,-0.125; CASE_2 3.4,-0.125 | smd 1.8 x 1.9: CASE_3 -4,-2.675; CASE_6 4,-2.675 | smd 1.9 x 1.9: CASE_4 -1.2,-2.675; CASE_5 1.2,-2.675
POWERPAK1212-8 = smd 0.405 x 0.99: 1 -0.99,-1.435; 2 -0.33,-1.435; 3 0.33,-1.435; 4 0.99,-1.435; 5 0.99,1.435; 6 0.33,1.435; 7 -0.33,1.435; 8 -0.99,1.435
SPST_2PIN_SMT = smd 2.18 x 1.6: 1 -4.59,0; 2 4.59,0
SPST_DIP4_SMT = smd 1.1 x 1.5: 1 -3.83,4.45; 2 -1.29,4.45; 3 1.25,4.45; 4 3.79,4.45; 5 3.79,-4.45; 6 1.25,-4.45; 7 -1.29,-4.45; 8 -3.83,-4.45
QFN64 = smd 0.95 x 0.3: 1 -4.5,3.75; 2 -4.5,3.25; 3 -4.5,2.75; 4 -4.5,2.25; 5 -4.5,1.75; 6 -4.5,1.25; 7 -4.5,0.75; 8 -4.5,0.25; 9 -4.5,-0.25; 10 -4.5,-0.75; 11 -4.5,-1.25; 12 -4.5,-1.75; 13 -4.5,-2.25; 14 -4.5,-2.75; 15 -4.5,-3.25; 16 -4.5,-3.75; 33 4.5,-3.75; 34 4.5,-3.25; 35 4.5,-2.75; 36 4.5,-2.25; 37 4.5,-1.75; 38 4.5,-1.25; 39 4.5,-0.75; 40 4.5,-0.25; 41 4.5,0.25; 42 4.5,0.75; 43 4.5,1.25; 44 4.5,1.75; 45 4.5,2.25; 46 4.5,2.75; 47 4.5,3.25; 48 4.5,3.75 | smd 0.3 x 0.95: 17 -3.75,-4.5; 18 -3.25,-4.5; 19 -2.75,-4.5; 20 -2.25,-4.5; 21 -1.75,-4.5; 22 -1.25,-4.5; 23 -0.75,-4.5; 24 -0.25,-4.5; 25 0.25,-4.5; 26 0.75,-4.5; 27 1.25,-4.5; 28 1.75,-4.5; 29 2.25,-4.5; 30 2.75,-4.5; 31 3.25,-4.5; 32 3.75,-4.5; 49 3.75,4.5; 50 3.25,4.5; 51 2.75,4.5; 52 2.25,4.5; 53 1.75,4.5; 54 1.25,4.5; 55 0.75,4.5; 56 0.25,4.5; 57 -0.25,4.5; 58 -0.75,4.5; 59 -1.25,4.5; 60 -1.75,4.5; 61 -2.25,4.5; 62 -2.75,4.5; 63 -3.25,4.5; 64 -3.75,4.5 | smd 5.6 x 5.6: PAD 0,0 | drill 0.3: VIA1 -2,2; VIA2 0,2; VIA3 2,2; VIA4 -2,0; VIA5 0,0; VIA6 2,0; VIA7 -2,-2; VIA8 0,-2; VIA9 2,-2
SOIC8 = smd 2.032 x 0.66: 1 -3.861,1.905; 2 -3.861,0.635; 3 -3.861,-0.635; 4 -3.861,-1.905; 5 3.861,-1.905; 6 3.861,-0.635; 7 3.861,0.635; 8 3.861,1.905
MRF24J40MA = smd 2.032 x 2.032: 1 -8.89,6.35; 2 -8.89,3.81; 3 -8.89,1.27; 4 -8.89,-1.27; 5 -8.89,-3.81; 6 -8.89,-6.35; 7 8.89,-6.35; 8 8.89,-3.81; 9 8.89,-1.27; 10 8.89,1.27; 11 8.89,3.81; 12 8.89,6.35
TQG144 = smd 1.6 x 0.3: 1 -10.7,8.75; 2 -10.7,8.25; 3 -10.7,7.75; 4 -10.7,7.25; 5 -10.7,6.75; 6 -10.7,6.25; 7 -10.7,5.75; 8 -10.7,5.25; 9 -10.7,4.75; 10 -10.7,4.25; 11 -10.7,3.75; 12 -10.7,3.25; 13 -10.7,2.75; 14 -10.7,2.25; 15 -10.7,1.75; 16 -10.7,1.25; 17 -10.7,0.75; 18 -10.7,0.25; 19 -10.7,-0.25; 20 -10.7,-0.75; 21 -10.7,-1.25; 22 -10.7,-1.75; 23 -10.7,-2.25; 24 -10.7,-2.75; 25 -10.7,-3.25; 26 -10.7,-3.75; 27 -10.7,-4.25; 28 -10.7,-4.75; 29 -10.7,-5.25; 30 -10.7,-5.75; 31 -10.7,-6.25; 32 -10.7,-6.75; 33 -10.7,-7.25; 34 -10.7,-7.75; 35 -10.7,-8.25; 36 -10.7,-8.75; 73 10.7,-8.75; 74 10.7,-8.25; 75 10.7,-7.75; 76 10.7,-7.25; 77 10.7,-6.75; 78 10.7,-6.25; 79 10.7,-5.75; 80 10.7,-5.25; 81 10.7,-4.75; 82 10.7,-4.25; 83 10.7,-3.75; 84 10.7,-3.25; 85 10.7,-2.75; 86 10.7,-2.25; 87 10.7,-1.75; 88 10.7,-1.25; 89 10.7,-0.75; 90 10.7,-0.25; 91 10.7,0.25; 92 10.7,0.75; 93 10.7,1.25; 94 10.7,1.75; 95 10.7,2.25; 96 10.7,2.75; 97 10.7,3.25; 98 10.7,3.75; 99 10.7,4.25; 100 10.7,4.75; 101 10.7,5.25; 102 10.7,5.75; 103 10.7,6.25; 104 10.7,6.75; 105 10.7,7.25; 106 10.7,7.75; 107 10.7,8.25; 108 10.7,8.75 | smd 0.3 x 1.6: 37 -8.75,-10.7; 38 -8.25,-10.7; 39 -7.75,-10.7; 40 -7.25,-10.7; 41 -6.75,-10.7; 42 -6.25,-10.7; 43 -5.75,-10.7; 44 -5.25,-10.7; 45 -4.75,-10.7; 46 -4.25,-10.7; 47 -3.75,-10.7; 48 -3.25,-10.7; 49 -2.75,-10.7; 50 -2.25,-10.7; 51 -1.75,-10.7; 52 -1.25,-10.7; 53 -0.75,-10.7; 54 -0.25,-10.7; 55 0.25,-10.7; 56 0.75,-10.7; 57 1.25,-10.7; 58 1.75,-10.7; 59 2.25,-10.7; 60 2.75,-10.7; 61 3.25,-10.7; 62 3.75,-10.7; 63 4.25,-10.7; 64 4.75,-10.7; 65 5.25,-10.7; 66 5.75,-10.7; 67 6.25,-10.7; 68 6.75,-10.7; 69 7.25,-10.7; 70 7.75,-10.7; 71 8.25,-10.7; 72 8.75,-10.7; 109 8.75,10.7; 110 8.25,10.7; 111 7.75,10.7; 112 7.25,10.7; 113 6.75,10.7; 114 6.25,10.7; 115 5.75,10.7; 116 5.25,10.7; 117 4.75,10.7; 118 4.25,10.7; 119 3.75,10.7; 120 3.25,10.7; 121 2.75,10.7; 122 2.25,10.7; 123 1.75,10.7; 124 1.25,10.7; 125 0.75,10.7; 126 0.25,10.7; 127 -0.25,10.7; 128 -0.75,10.7; 129 -1.25,10.7; 130 -1.75,10.7; 131 -2.25,10.7; 132 -2.75,10.7; 133 -3.25,10.7; 134 -3.75,10.7; 135 -4.25,10.7; 136 -4.75,10.7; 137 -5.25,10.7; 138 -5.75,10.7; 139 -6.25,10.7; 140 -6.75,10.7; 141 -7.25,10.7; 142 -7.75,10.7; 143 -8.25,10.7; 144 -8.75,10.7
VDFN10 = smd 0.8 x 0.3: 1 -1.5,1; 2 -1.5,0.5; 3 -1.5,0; 4 -1.5,-0.5; 5 -1.5,-1; 6 1.5,-1; 7 1.5,-0.5; 8 1.5,0; 9 1.5,0.5; 10 1.5,1 | drill 0.3 pad 0.61: P$1 -0.5,0.5; P$2 0.5,0.5; P$3 0.5,-0.5; P$4 -0.5,-0.5
SSOP28 = smd 1.25 x 0.42: 1 -3.375,4.225; 2 -3.375,3.575; 3 -3.375,2.925; 4 -3.375,2.275; 5 -3.375,1.625; 6 -3.375,0.975; 7 -3.375,0.325; 8 -3.375,-0.325; 9 -3.375,-0.975; 10 -3.375,-1.625; 11 -3.375,-2.275; 12 -3.375,-2.925; 13 -3.375,-3.575; 14 -3.375,-4.225; 15 3.375,-4.225; 16 3.375,-3.575; 17 3.375,-2.925; 18 3.375,-2.275; 19 3.375,-1.625; 20 3.375,-0.975; 21 3.375,-0.325; 22 3.375,0.325; 23 3.375,0.975; 24 3.375,1.625; 25 3.375,2.275; 26 3.375,2.925; 27 3.375,3.575; 28 3.375,4.225
DFN8 = smd 0.25 x 0.68: 1 -0.75,-1.39; 2 -0.25,-1.39; 3 0.25,-1.39; 4 0.75,-1.39; 5 0.75,1.39; 6 0.25,1.39; 7 -0.25,1.39; 8 -0.75,1.39 | smd 2.4 x 1.7: 9 0,0
QFN44 = smd 0.7 x 0.25: 1 -3.4,2.5; 2 -3.4,2; 3 -3.4,1.5; 4 -3.4,1; 5 -3.4,0.5; 6 -3.4,0; 7 -3.4,-0.5; 8 -3.4,-1; 9 -3.4,-1.5; 10 -3.4,-2; 11 -3.4,-2.5; 23 3.4,-2.5; 24 3.4,-2; 25 3.4,-1.5; 26 3.4,-1; 27 3.4,-0.5; 28 3.4,0; 29 3.4,0.5; 30 3.4,1; 31 3.4,1.5; 32 3.4,2; 33 3.4,2.5 | smd 0.25 x 0.7: 12 -2.5,-3.4; 13 -2,-3.4; 14 -1.5,-3.4; 15 -1,-3.4; 16 -0.5,-3.4; 17 0,-3.4; 18 0.5,-3.4; 19 1,-3.4; 20 1.5,-3.4; 21 2,-3.4; 22 2.5,-3.4; 34 2.5,3.4; 35 2,3.4; 36 1.5,3.4; 37 1,3.4; 38 0.5,3.4; 39 0,3.4; 40 -0.5,3.4; 41 -1,3.4; 42 -1.5,3.4; 43 -2,3.4; 44 -2.5,3.4 | smd 5.12 x 5.12: 45 0,0
3.2X2.5_OSC = smd 1.6 x 1.4: 1 -1.25,-0.875; 2 1.25,-0.875; 3 1.25,0.875; 4 -1.25,0.875

### Placement (x,y rotation side)
15K  23,17.62 90 bottom
C1  8.5,28.25 270 top
C2  6,24.89 270 top
C3  3.25,25 270 top
C4  40,20 270 top
C5  6.25,28.25 270 top
C6  8.46,24.89 270 top
C7  26,42 0 top
C8  28.5,15.25 180 top
C9  4,28.25 270 top
C10  4,34.25 90 top
C11  1.75,31.25 270 top
C12  28.5,13 180 top
C13  1.75,28.25 270 top
C14  26,44.25 0 top
C15  40,23 90 top
C16  8.5,34.25 90 top
C17  1.75,34.25 90 top
C18  37.75,23 90 top
C19  6.25,31.25 270 top
C20  6.25,34.25 90 top
C21  28.5,10.75 180 top
C22  4,31.25 270 top
C23  42.25,23 90 top
C24  37.75,20 270 top
C25  8.25,26 90 bottom
C26  12.75,26 90 bottom
C27  15,26 90 bottom
C28  3.5,32 180 bottom
C29  21.5,31 90 bottom
C30  12.25,37.25 90 bottom
C31  21.25,37.75 90 bottom
C32  16.75,8 270 bottom
C33  9.25,17.5 0 bottom
C34  10.75,10.5 180 bottom
C35  46.25,46.5 0 top
C36  42.75,42.5 90 top
J1  53.75,47 270 top
J2  54.88,40 180 top
J3  24,48.5 0 top
J4  28.75,48.5 0 top
J5  14.5,4 90 top
J6  23.38,13.38 0 top
J8  4.75,25.25 90 bottom
J9  4.75,6.5 90 bottom
J10  4.88,15 90 top
L1  10.5,26 90 bottom
L2  15.5,29.75 0 bottom
L3  15.5,38.75 180 bottom
LED0  32,48.5 90 top
LED1  34.25,48.5 90 top
LED2  36.5,48.5 90 top
LED3  38.75,48.5 90 top
LED4  9,47.75 90 top
LED5  11.25,47.75 90 top
LED6  13.5,47.75 90 top
LED7  15.75,47.75 90 top
M1  36.88,48.12 0 bottom
M2  32.75,48.12 0 bottom
PWR  2,47.75 270 top
R1  46.3,25.75 0 top
R2  53.75,36 180 top
R3  32,45.25 90 top
R4  34.25,45.25 90 top
R5  36.5,45.25 90 top
R6  38.75,45.25 90 top
R7  41.5,11 180 top
R8  9,44.25 90 top
R9  11.25,44.25 90 top
R10  13.5,44.25 90 top
R11  15.75,44.25 90 top
R12  37,36.5 270 bottom
R13  37,32.25 90 bottom
R14  30,40.75 0 bottom
R15  44,18 180 top
R16  17.5,21 90 bottom
R17  41.25,50.25 270 bottom
R18  17.25,26 90 bottom
R19  41.25,47 270 bottom
R20  13.5,21 270 bottom
R21  48.75,48.75 90 bottom
R22  44.5,23 90 top
R23  27.5,19.25 0 bottom
R24  23,24 90 bottom
R25  23,21.25 90 bottom
R26  6.5,44.25 90 top
R27  4.25,44.25 90 top
R28  19.35,30.75 90 bottom
R29  17.35,34 90 bottom
R30  19.6,34 90 bottom
R31  18.85,37.75 90 bottom
R32  2,44.25 90 top
R33  18.25,8 90 bottom
R34  19.75,8 90 bottom
R35  41.5,5.5 180 top
R36  50.5,22.5 180 bottom
RX  4.25,47.75 270 top
S1  37,8.25 0 top
S2  37,13.75 0 top
S3  44,34.38 270 bottom
S4  37,2.5 0 top
TX  6.5,47.75 270 top
U1  45.25,34.25 180 top
U2  53.12,25.62 180 top
U3  50.5,11 90 bottom
U4  23.02,28.81 90 top
U5  27.5,33.5 270 bottom
U6  8.25,21.25 270 bottom
U7  45,48.75 180 bottom
U8  27.5,22.25 0 bottom
U9  5.75,38.25 0 bottom
U10  15,34 0 bottom
U11  17.25,14.5 90 bottom
X1  46.25,42.5 0 top
X2  37,29.5 270 top
X3  20.5,44 270 top
X4  9.25,14 270 bottom

### Tracks (layer width: path | path; a pad name or v marks a point on that pad's centre or on a via)
1V2  (via drill 0.2)
  PowerPlane 0.305: v21.75,40.75 24.12,43.12 29.88,43.12 35.75,49 v39.75,49
  Bottom 0.305: U7.3 41.8,48.75 R17.2 40.05,49.3 v39.75,49
  other vias: 18.25,40.75
  pour Bottom (isolate 0.406, no thermals): 16,38 16,40.75 22,40.75 22,38.25 18,38.25 17.75,38
3V3  (via drill 0.2)
  Top 0.305: R22.2 v44.5,24.75 | J1.2 54.54,51.25 45.5,51.25 43.75,49.5 v43.75,45.5
  PowerPlane 0.305: 50.12,24.38 49.75,24.75 v44.5,24.75 43.88,24.12 32.12,24.12 | v20.25,24 21.25,24 v22.12,24.88 22.88,24.88 24.25,23.5 v22.12,21.38 | v16.75,37.25 16.75,30 v16.5,29.75 | v43.75,45.5 50.12,39.38 50.12,24.38 | 50.12,24.38 v50.88,23.62 | 32.12,24.12 v30.25,22.25 | v28.12,24.12 32.12,24.12
  Bottom 0.305: U8.1 v28.12,24.12 27.3,24.95 R24.2 22.07,24.95 v22.12,24.88 | R36.1 49.8,22.55 v50.88,23.62 | U7.1 43.5,47 42.55,46.05 R19.2 43.2,46.05 v43.75,45.5 | R16.2 19.55,24 v20.25,24 | R28.1 19.35,24.9 v20.25,24 | U10.7 15.25,36.5 16,37.25 v16.75,37.25 | U8.3 v30.25,22.25 | U6.3 8.25,23.5 8.62,23.88 10.55,23.88 10.8,23.62 16.5,23.62 16.88,24 v20.25,24 | R25.1 23,20.5 v22.12,21.38
  other vias: 18.75,29.75 20.5,29.75
  pour Bottom (isolate 0.406, no thermals): 16,29 16,30.5 22,30.5 22,29.5 20,29
5V  (via drill 0.2)
  Top 0.305: PWR.1 RX.1 TX.1 7.55,48.7 8,48.25 8,39.25 | v11,36.25 8,39.25 | 8,39.25 7.5,39.75 v7,39.75
  PowerPlane 0.305: v13.88,24.25 13.5,24.5 7.5,24.5 v6.25,22.75 6.25,31.5 v11,36.25 | v13.75,35.75 13.75,32.5 14.5,31.75 v14.75,31.75
  Bottom 0.305: U10.2 U10.3 v14.75,31.75 | U9.20 4.53,37.27 v7,39.75 7.78,40.52 U9.4 | v6.25,22.75 U6.1 | v13.88,24.25 16.45,24.25 R18.1
  pour Bottom (no thermals): 14.35,35.1 14.35,36 13.5,36.75 10.9,36.75 10.9,35.75 13,35.75
A8
  Top 0.125: U1.35 39,37 33.75,42.25 28.75,42.25 26.75,40.25 26.75,39.53 U4.83
A9
  Top 0.125: U1.36 39,36.5 33.5,42 29,42 27.25,40.25 27.25,39.53 U4.82
A10
  Top 0.125: U1.37 39,36 33.25,41.75 29.25,41.75 27.75,40.25 27.75,39.53 U4.81
A11
  Top 0.125: U1.38 39,35.5 33,41.5 29.5,41.5 28.25,40.25 28.25,39.53 U4.80
A12
  Top 0.125: U1.39 39,35 32.75,41.25 29.75,41.25 28.75,40.25 28.75,39.53 U4.79
A13
  Top 0.125: U4.78 29.27,40.27 30,41 32.5,41 32.75,40.75 | 32.75,40.75 33,40.5 | 32.75,40.75 39,34.5 U1.40
A14
  Top 0.125: U1.41 39,34 32.25,40.75 31.25,40.75 30.77,40.27 U4.75
A15
  Top 0.125: U4.74 31.27,40.27 31.5,40.5 32,40.5 39,33.5 U1.42
AD0/SELECTMAP_D7  (via drill 0.2)
  Top 0.125: U4.48 v36.5,25.56 | v39.56,25.56 42.5,28.5 U1.51
  Bottom 0.125: v36.5,25.56 v39.56,25.56
AD1/SELECTMAP_D6
  Top 0.125: 33.78,23 36.25,23 42,28.75 U1.50
  Top 0.152: 33.78,23 U4.43
AD2/SELECTMAP_D5/MCU_RX1
  Top 0.125: U4.44 36.25,23.56 41.5,28.81 U1.49
AD3/SELECTMAP_D4/MCU_TX1
  Top 0.125: U4.45 36.25,24.06 40.25,28.06 40.25,30 U1.48
AD4/SELECTMAP_D3
  Top 0.125: U1.47 40.25,31 40,30.75 40,28.31 36.25,24.56 U4.46
AD5/SELECTMAP_D2/FPGA_MISO3  (via drill 0.2)
  Top 0.125: U1.46 39.25,31.5 38.69,32.06 U4.61 28.06,32.06 v27.75,31.75
  Bottom 0.125: v27.75,31.75 27.02,31.02 U5.7
AD6/SELECTMAP_D1/FPGA_MISO2  (via drill 0.2)
  Top 0.125: U1.45 39.25,32 38.69,32.56 U4.62 29.69,32.56 v28.75,33.5
  Bottom 0.125: v28.75,33.5 28.3,33.95 U5.3
AD7/SELECTMAP_D0/FPGA_MISO1  (via drill 0.2)
  Top 0.125: U1.44 39.25,32.5 38.88,32.88 36.12,32.88 34.94,34.06 U4.65 27.69,34.06 v27.5,34.25
  Bottom 0.125: v27.5,34.25 26.86,34.88 U5.2
ALE
  Top 0.125: U4.66 34.94,34.56 36.38,33.12 39.12,33.12 39.25,33 U1.43
CCLK  (via drill 0.2)
  Top 0.125: v32.5,36.5 32.56,36.56 U4.70 | U1.26 44.5,39.5 v43.25,40.75
  Bottom 0.125: U5.6 28.3,32.3 v32.5,36.5 36.75,40.75 v43.25,40.75
CSI_B/FPGA_MISO0  (via drill 0.2)
  Top 0.125: U4.64 30.56,33.56 v30.5,33.5 | U1.25 45,39.75 v44.5,40.25
  Bottom 0.125: U5.5 29.57,32.5 30.5,33.44 v30.5,33.5 37.25,40.25 v44.5,40.25
CSO_B  (via drill 0.2)
  Top 0.125: U4.38 32.69,20.56 26.25,27 v26.25,32.5
  Bottom 0.125: v26.25,32.5 25.75,32.99 U5.1 25.59,38.3 28.05,40.75 R14.2
D+
  Bottom 0.125: U11.4 R33.2
D-
  Bottom 0.125: U11.3 18.75,10.5 19.75,9.5 R34.2
ENABLE_LEDS  (via drill 0.2)
  Top 0.125: U1.9 49.12,34.5 48.88,34.75 v48.88,37.25
  Bottom 0.125: S3.3 41.38,34.95 41.38,35.88 42.5,37 48.62,37 v48.88,37.25
FPGA_DONE  (via drill 0.2)
  Top 0.125: U4.71 34.94,37.06 v38.25,33.62 | U1.8 49,34 v48.62,34.38
  Bottom 0.125: 47.62,33.88 47,33.25 42.12,33.25 40.5,31.62 39,31.62 38.25,32.38 v38.25,33.62
  Bottom 0.127: 47.62,33.88 48.12,34.38 v48.62,34.38
FPGA_GPIO_0
  Top 0.125: U4.1 14.27,14.77 10.25,10.75 6,10.75 3.07,7.83 J5.1
FPGA_GPIO_1
  Top 0.125: U4.2 14.77,14.77 10.5,10.5 6.25,10.5 4.25,8.5 4.25,2.35 J5.20
FPGA_GPIO_2
  Top 0.125: U4.5 16.27,15.75 10.77,10.25 7.54,10.25 5.61,8.32 J5.2
FPGA_GPIO_3
  Top 0.125: U4.6 16.77,15.75 11.02,10 7.75,10 6.75,9 6.75,3.31 6.72,3.26 6.72,2.29 J5.19
FPGA_GPIO_4
  Top 0.125: J5.3 8.32,7.83 10.25,9.75 11.27,9.75 17.27,15.75 U4.7
FPGA_GPIO_5
  Top 0.125: U4.8 17.77,15.75 11.52,9.5 10.5,9.5 9,8 9,2.02 J5.18
FPGA_GPIO_6
  Top 0.125: U4.9 18.27,15.75 10.85,8.32 J5.4
FPGA_GPIO_7
  Top 0.125: U4.10 18.77,15.77 11.75,8.75 11.75,2.23 J5.17
FPGA_GPIO_8
  Top 0.125: U4.11 19.27,15.77 13.23,9.73 J5.5
FPGA_GPIO_9
  Top 0.125: U4.12 19.77,15.77 13.75,9.75 13.75,8.62 14.25,8.12 14.25,3.25 13.23,2.23 J5.16
FPGA_GPIO_10
  Top 0.125: U4.15 21.27,15.27 16.75,10.75 16.75,3.25 15.77,2.27 J5.15
FPGA_GPIO_11
  Top 0.125: U4.14 20.77,15.27 15.77,10.27 J5.6
FPGA_GPIO_12
  Top 0.125: U4.17 22.27,15.27 19.25,12.25 19.25,3.25 18.31,2.31 J5.14
FPGA_GPIO_13
  Top 0.125: U4.16 21.77,15.27 18.31,11.81 J5.7
FPGA_GPIO_14
  Top 0.125: 24.25,18.09 U4.21 24.27,15.98 24.5,15.75 24.5,11.25 20.85,7.6 J5.8
FPGA_GPIO_15
  Top 0.125: J5.13 20.85,2.35 21.75,3.25 21.75,7.62 24.75,10.62 24.75,18.09 U4.22
FPGA_GPIO_16
  Top 0.125: J5.9 23.39,7 25.27,8.88 U4.23
FPGA_GPIO_17
  Top 0.125: J5.12 24.5,2.29 24.5,7.5 25.77,8.77 U4.24
FPGA_GPIO_18
  Top 0.125: U4.27 27.27,9.52 25.93,8.18 J5.10
FPGA_GPIO_19
  Top 0.125: J5.11 24.75,2.35 24.75,7.38 26.77,9.39 U4.26
FPGA_LED0
  Top 0.125: U4.105 15.77,40.98 15.5,41.25 11.05,41.25 R8.1
FPGA_LED1
  Top 0.125: U4.104 16.27,40.98 15.75,41.5 13.05,41.5 R9.1
FPGA_LED2
  Top 0.125: U4.102 17.27,40.48 16,41.75 15.05,41.75 R10.1
FPGA_LED3
  Top 0.125: U4.101 17.75,39.53 17.75,40.5 15.75,42.5 R11.1
FPGA_POWER  (via drill 0.2)
  Top 0.125: U1.5 v51.75,32.5
  PowerPlane 0.125: v35.12,46.88 35.12,46.12 36.12,45.12 v36.62,45.12 37.5,46 45.75,46 51,40.75 51,37.62 52.38,36.25 52.38,33.12 v51.75,32.5
  Bottom 0.125: M1.4 35.31,46.69 v35.12,46.88 | M2.4 31.76,45.37 32,45.12 v36.62,45.12
FPGA_RESET
  Top 0.125: U4.37 33.72,17.75 37.72,13.75 S2.2 41.59,14.64 R15.1 45.6,18.65 | 45.6,18.65 46,19.05 | U1.59 46.5,19.55 45.6,18.65
FPGA_SUSPEND  (via drill 0.2)
  Top 0.125: v51.75,34.38 50.88,33.5 U1.7 | v33.38,38.5 32.37,39.51 U4.73
  Bottom 0.125: v51.75,34.38 51.75,42 50.88,42.88 48.38,42.88 46.75,41.25 36.12,41.25 v33.38,38.5
FPGA_VCCAUX  (via drill 0.2)
  Top 0.125: X2.1 X2.4
  Top 0.305: C12.1 C8.1 29,16.75 29.27,17.02 U4.31 29.27,19.27 29.75,19.75 | C12.1 C21.1 29,9.75 v29.5,9.25 | C12.1 29,14 31.77,16.77 U4.36 31.77,19.23 v31.25,19.75 29.75,19.75 | C15.1 38.2,22.05 C18.1 v36.75,22.5 36.69,22.56 U4.42 31.69,22.56 30.5,23.75 30.5,26 32.56,28.06 | C15.1 C23.1 42.95,22.05 v43.5,21.5 | C15.1 C4.1 C24.1 37.05,20.95 v36.5,21.5 | R15.2 42.25,18 v41.75,17.5 | 9.75,25.25 9.16,25.84 C6.1 C2.1 4.11,25.84 3.37,25.93 | 9.75,25.25 9.75,25 11.19,24.56 U4.135 | 9.75,25.25 9.75,26 11.31,27.56 U4.129 13.56,27.56 14.25,28.25 14.25,29 | 3.37,25.93 C3.1 1.37,25.95 0.73,26.58 v0.62,26.62 | v0.75,31.5 1,31.75 C11.1 C22.1 C19.1 8.95,31.75 | C20.1 6.4,33.3 | C20.1 C10.1 C17.1 1.05,33.3 v0.75,33 | 14.25,29 14.25,30.25 13.44,31.06 U4.122 9.64,31.06 8.95,31.75 | X3.1 X3.4 | J3.1 21.38,47.15 X3.4 | X3.4 22.25,45.25 23.25,44.25 C14.1 25.05,42.45 C7.1 25.27,41.77 U4.86 25.27,38.48 28.75,35 v29.5,35 29.5,36.75 30.27,37.52 U4.76 | U4.90 23.27,38.27 22.5,37.5 17.5,37.5 | U4.103 16.77,38.23 17.5,37.5 | X2.1 35,29.62 35,28.25 34.81,28.06 U4.53 32.56,28.06 | U4.4 15.77,19.27 17.12,20.5 21.5,20.5 22.77,19.23 | U4.125 13.69,29.56 14.25,29 | 32.56,28.06 31.69,28.06 v30.5,29.25 | U4.20 23.77,16.77 23.5,16.5 23,16.5 22.77,16.73 U4.18 22.77,19.23 | 29.75,19.75 28,19.75 27,20.75 23.5,20.75 22.77,20.02 22.77,19.23 | v31.25,33 31.31,33.06 U4.63 | 17.5,37.5 20,35 v24,35 | C16.1 C20.1 | 8.95,31.75 8.5,32.2 C16.1 | v9.75,32.75 9.2,33.3 C16.1 | 2.44,25.93 3.37,25.93
  PowerPlane 0.305: v29.5,35 29.5,30.25 v30.5,29.25 30,29.75 v24.25,29.75 22.5,29.75 21.5,28.75 14.75,28.75 v9.75,32.75 | v31.25,33 v34.88,36.5 33.25,35 v29.5,35 | v31.25,19.75 33,21.5 v36.5,21.5 | v43.5,21.5 43.5,20 41.75,18.25 v41.75,17.5 | v24,35 v29.5,35
  Bottom 0.305: R13.1 36.05,31.3 34,29.25 v30.5,29.25 | U5.8 25.48,29.75 v24.25,29.75 | R14.1 31.75,40.75 32.5,40 32.5,38 v29.5,35 | R12.1 35.7,37.45 v34.88,36.5 | J3.1 28.52,45.25 29.88,45.25 30.62,46 30.62,48.88 31.31,49.56 M2.5 M2.6 M2.7 M2.8
  pour PowerPlane: 0.75,51.25 0.75,0.5 38.25,0.5 38.25,51.25
FPGA_VCCAUX_MON
  Bottom 0.305: U7.2 41.55,48.25 R19.1 40.58,47.95 38.38,45.75 34.68,45.75 M2.1 M2.2 M2.3
FPGA_VCCINT  (via drill 0.2)
  Top 0.305: C1.1 C5.1 C9.1 1.7,29.2 C13.1 1.62,29.25 v0.75,29.75 | U4.128 9.64,28.06 C1.1 | C1.1 9.45,29.2 v9.75,29.5 | J4.1 27.52,51 23,51 18.5,46.5 18.5,44.25 18.75,44 22.25,44 23.77,42.48 U4.89 23.77,36.98 27,33.75 27,27.75 v28.75,26 | U4.28 27.77,19.25 27.27,19.75 v24.5,19.75 23.75,19.75 23.27,19.27 U4.19 | U4.52 32.81,27.56 v31.25,26
  PowerPlane 0.305: v31.25,26 v28.75,26 | v9.75,29.5 14.25,26 v28.75,26 | v28.75,26 24.5,21.75 v24.5,19.75
  Bottom 0.305: M1.8 M1.7 M1.6 M1.5 35.19,49.56 34,50.75 29.73,50.75 J4.1
FPGA_VCCINT_MON
  Bottom 0.305: U7.4 42.75,49.25 42.25,49.75 42.25,50.2 R17.1 39.95,51.2 39,50.25 39,47.83 M1.1 M1.2 M1.3
FTDI_RXLED  (via drill 0.2)
  Top 0.125: R27.1 4.25,38 v5.75,36.25
  Bottom 0.125: v5.75,36.25 7.97,34.02 U9.14
GND  (via drill 0.2, 0.35)
  Top 0.305: v28.25,16.25 28,16 C8.2 C12.2 C21.2 28,9.75 v27.5,9.12 | 4.5,24.02 5.11,23.94 C2.2 7,24 6.75,24.75 7.65,24.75 C6.2 9.58,24.06 U4.136 | 4.29,24.05 4.5,24.02 | 4.29,24.05 C3.2 2.92,24.05 v1.5,22.62 | v1,28 1.5,28 C13.2 2.2,27.3 C9.2 C5.2 C1.2 9.32,27.3 v9.5,27.5 | C19.2 C22.2 C11.2 v1,30.75 | v0.75,36 1.05,35.2 C17.2 C10.2 C20.2 | U4.3 15.27,20.73 v14.75,21.25 | 20.27,16.75 20.27,15.52 v17.25,12.5 | U4.77 29.77,38.52 28.75,37.5 v28.75,35.75 | v43.55,28.75 43.5,28.8 U1.53 | 3.96,24.05 4.29,24.05 | 3.98,24.02 4.5,24.02 | U4.47 32.06,25.06 v32,25 | v23.12,41.12 22.77,40.77 U4.91 | U4.130 14.56,27.06 v15.38,28 | U1.63 48.5,28.62 v48.75,28.38
  Top 0.406: v20.25,19.38 20.25,18.13 U4.13 20.27,16.75
  Bottom 0.305: U9.18 1.27,35.98 v0.75,36 | U11.45 16.25,14.5 15.25,13.5 U11.15 | U11.43 19.25,12.5 U11.45 | U11.35 19.25,16.5 U11.45 | U11.23 14.75,16.75 15.75,15.75 16,15.75 U11.45
  other vias: 39,29.5 42.75,25.5 19.5,41.25 11.25,12.5 15.5,16.25 26.12,24.38 41.75,21 31.25,30.75 26.25,14.38 36.5,17.5 39.75,16.25 46.75,8.75 35,33 36.75,34.25 6,4.75 8,4 10.75,4 13.25,4 15.75,4 18.25,4 21,4 23.5,4 24,9 24.5,1 49.88,15.12 51,11.12 49.5,12 55.38,29 53.25,31.5 51.75,33.75 30,16.25 39.12,39.38 11.75,17 10.75,39 20.5,47.25 54,50 53.25,48.25 50,40.5 53.88,42.62 56.5,30 3.88,32.5 10.5,25.75 45.5,4 43.38,23 46.5,40.25 4.88,17.62 17.75,10.38
  pour Top (rank 2, hatched): 0.5,51.5 57.75,52 57.75,0.5 0.5,0.5
  pour Bottom (rank 2, hatched): 0.5,51.5 57.5,51.75 57.5,1 0.5,1
  pour GroundPlane (isolate 0.406, hatched): 0.75,52 58,52 58,0.38 0.5,0.5
INIT_B
  Top 0.125: U4.39 35.69,21.06 36.75,20 44.75,20 46,21.25 U1.58
JTAG_TCK  (via drill 0.2)
  Top 0.125: U1.57 45.5,28 v44.75,27.25 | v24.25,27.5 14.19,37.56 U4.109
  Bottom 0.125: v44.75,27.25 24.5,27.25 v24.25,27.5
JTAG_TDI  (via drill 0.2)
  Top 0.125: U1.55 44.5,28 v43.25,26.75 | U4.110 13.94,37.06 v24.25,26.75
  Bottom 0.125: v43.25,26.75 v24.25,26.75
JTAG_TDO  (via drill 0.2)
  Top 0.125: U1.56 v45,28.75 | v24.25,29 15.27,37.98 U4.106
  Bottom 0.125: v24.25,29 25,28.25 44.5,28.25 v45,28.75
JTAG_TMS  (via drill 0.2)
  Top 0.125: U1.54 44,28.5 v43.25,27.75 | v24.25,28.25 14.77,37.73 U4.107
  Bottom 0.125: v24.25,28.25 24.75,27.75 v43.25,27.75
MCU_FLASH_CE
  Top 0.125: U1.14 51.81,37 52.8,36.01 R2.2 52.8,28.38 52.81,27.75 | U2.1 54.97,23.78 54.56,24.19 | 52.83,26.78 52.82,27.25 | 52.82,27.25 52.81,27.75 | 52.81,27.75 52.81,25.94 54.56,24.19 | 52.82,27.25 52.82,25.93 54.56,24.19
MCU_GPIO_0
  Top 0.125: U1.17 49,39.25 49.5,39.75 55.1,39.75 J2.1
MCU_GPIO_1
  Top 0.125: U1.18 48.5,39.25 49.25,40 54.9,40 J2.2
MCU_GPIO_2
  Top 0.125: U1.19 48,39.25 50,41.25 J2.3
MCU_GPIO_3
  Top 0.125: U1.16 50.46,38.71 J2.4
MCU_LED0
  Top 0.125: U1.32 41.5,39.75 40.75,40.5 37,40.5 34.5,43 32.5,43 32,43.5 R3.1
MCU_LED1
  Top 0.125: U1.31 42,39.75 41,40.75 37.25,40.75 34.25,43.75 R4.1
MCU_LED2
  Top 0.125: U1.30 42.5,39.75 41.25,41 37.5,41 36.5,42 R5.1
MCU_LED3
  Top 0.125: U1.29 43,39.75 41,41.75 39.25,41.75 38.75,42.25 R6.1
MCU_MISO  (via drill 0.2)
  Top 0.125: U1.13 50.75,36.5 52.5,34.75 52.5,25.62 | U2.2 54.38,24.99 v53.88,25.5 | v53.5,24.12 52.5,23.12 52.5,23 52.5,25.62 | v52,13 52.5,13.5 52.5,25.62
  Bottom 0.125: v53.88,25.5 53.88,24.5 v53.5,24.12 | U3.7 44.15,15.6 46.75,13 v52,13
MCU_MOSI  (via drill 0.2)
  Top 0.125: U1.12 50.75,36 52.25,34.5 52.25,28 | v51.75,14.75 52.25,15.25 52.25,28 | 52.25,28 51.78,27.53 U2.5
  Bottom 0.125: 46.69,2.44 U3.5 46.69,4.44 52.75,10.5 52.75,14.25 52.25,14.75 v51.75,14.75
MCU_RESET  (via drill 0.2)
  Top 0.125: S1.2 41.59,10.14 R7.1 | R7.1 42.45,10.8 | J1.5 51.17,43.17 v49.5,41.5 47.5,39.5 U1.20 | R7.1 47.5,16.18 47.55,16.23 v47.55,24.12
  Bottom 0.125: v49.5,41.5 49.5,25.62 48,24.12 v47.55,24.12
MCU_RX0/PDI  (via drill 0.2)
  Top 0.125: J1.4 54.75,47 54.25,46.5 54.25,43 54.75,42.5 56.38,42.5 57.38,41.5 57.38,32.5 v55.38,30.5 | v51.5,30.5 51,31 U1.2
  Bottom 0.125: v51.5,30.5 v55.38,30.5
MCU_RX1  (via drill 0.2)
  Top 0.125: U1.27 44,39.25 v43.5,39.75
  PowerPlane 0.125: v11.25,42 15.25,38 38.75,38 40.5,39.75 v43.5,39.75
  Bottom 0.125: U9.1 10.78,42.48 v11.25,42
MCU_SCK  (via drill 0.2)
  Top 0.125: v50.75,34.5 50.75,35.25 50.5,35.5 U1.11 | J1.3 53,47 53.25,46.75 53.25,43.75 51.94,42.44 51.06,42.44 v50.75,42.12 | U2.6 50.87,26.26 51.38,25.75 v51.38,24.88 51.38,18.62 48.88,16.12 v48.88,9.12
  Bottom 0.125: v51.38,24.88 50.75,25.5 v50.75,34.5 v50.75,42.12 | U3.6 44.15,4.4 v48.88,9.12
MCU_TX0/PDO  (via drill 0.2)
  Top 0.125: J1.1 52.96,49.54 53.75,48.75 53.75,43.88 51.62,41.75 v51.25,41.75 | U1.3 v51.25,31.5
  Bottom 0.125: v51.25,41.75 v51.25,31.5
MCU_TX1  (via drill 0.2)
  Top 0.125: U1.28 43.5,38.25 43.12,37.88 v41.62,37.88
  PowerPlane 0.125: v12,39.5 13.75,37.75 41.5,37.75 v41.62,37.88
  Bottom 0.125: v12,39.5 11.62,39.88 U9.5
MCU_VCC  (via drill 0.2, 0.35)
  Top 0.305: R22.1 45.5,23.05 45.5,24.5 45.35,24.65 R1.1 44.62,25.75 | 44.62,25.75 43.25,25.75 42.5,26.5 42.5,27.75 43,28.25 U1.52 43,30.5 43.25,30.75 | U2.7 U2.8 49.24,23.39 v48.5,22.62 | R2.1 v55.75,36 | v47.5,40.5 47,40 U1.21 47,38 46.38,37.38 42.25,37.38 42,37.12 42,31.25 42.5,30.75 43.25,30.75 | 48,30.75 43.25,30.75 | R7.2 39.75,11.8 v39.75,12.5 | v55,27.25 55.99,26.24 U2.3 | v40.75,24.88 43.62,24.88 44.62,25.75 | U1.62 48,30.75 | v43.12,51 41.5,49.38 v41.5,44.75 | U1.64 49,30.25 48.62,30.75 48,30.75
  Bottom 0.305: U8.4 29.75,21.75 30.25,21.25 33,21.25 36,24.25 40.25,24.25 v40.75,24.88
  pour PowerPlane: 39,51.25 39,0.5 57.5,0.5 57.5,51.25
MODE0  (via drill 0.2)
  Top 0.125: U4.69 35.44,36.06 v35.5,35.5
  Bottom 0.125: v35.5,35.5 37,35.5 37.04,35.54 | R12.2 39.55,38.1 S3.1
  Bottom 0.305: R12.2 37,35.5
MODE1  (via drill 0.2)
  Top 0.125: U4.60 34.94,31.56 v35,31.5
  Bottom 0.125: v35,31.5 36.7,33.2 R13.2 39.47,35.66 S3.2
MON_HWB
  Bottom 0.125: U11.33 21.77,17.9 15K.1 23.38,16.3 J6.1
MON_MISO  (via drill 0.2)
  Top 0.125: J10.1 7.71,12.46 v7,11.75
  PowerPlane 0.125: v14.25,9.5 9.25,9.5 v7,11.75
  Bottom 0.125: U11.11 14.75,10 v14.25,9.5
MON_MOSI  (via drill 0.2)
  Top 0.125: v5.12,13.75 3.25,15 J10.4
  PowerPlane 0.125: v14.75,9 9,9 6.5,11.5 5.12,13 v5.12,13.75
  Bottom 0.125: U11.10 15.25,9.5 v14.75,9
MON_RESET  (via drill 0.2)
  Top 0.125: R35.1 41.59,4.64 S4.2 35,2.5 29.5,8 v27,8 | J10.5 10.21,17.54 11.25,16.5 v11.25,13.25
  Bottom 0.125: U11.13 13.5,12.5 13,12 13,11.5 | 13,11.5 13,10 15,8 v27,8 | v11.25,13.25 13,11.5
MON_SCK  (via drill 0.2)
  Top 0.125: v4.38,15 J10.3 7.75,15
  PowerPlane 0.125: v15.25,8.5 9,8.5 4.38,13.12 v4.38,15
  Bottom 0.125: U11.9 15.75,9 v15.25,8.5
MON_VCC  (via drill 0.2)
  Top 0.305: R35.2 39.5,5.5 v39.25,5.25
  Top 0.406: v6.25,19.12 0.75,19.12 0.5,18.88 0.5,13.25 1.29,12.46 J10.2
  PowerPlane 0.305: 10.75,20.75 10.75,14.75 v12,13.5 31,13.5 v39.25,5.25 | 10.75,20.75 v10.75,22.75 19,22.75 19.25,22.75 v20.5,21.5 | 10.75,20.75 9.12,19.12 v6.25,19.12 3.25,21.88 3.25,41.25 13.88,51.88 39,51.88 v44.38,46.5
  PowerPlane 0.406: 19,22.75 21.62,22.75 v22.88,24
  Bottom 0.305: U11.24 15.25,18.75 16.55,20.05 R16.1 18.75,20.05 | U11.44 21.5,12 | v12,13.5 12.5,13 U11.14 | v20.5,21.5 20.2,21.5 18.75,20.05 | v10.75,22.75 10.06,23.44 8.94,23.44 8.75,23.25 U6.4 | v6.25,19.12 7.25,19.12 U6.10 | v44.38,46.5 45.62,46.5 46.5,47.38 U7.10 | 21.5,12 22,12.5 22,16.25 21.25,17 U11.34 | 18.75,20.05 21.52,20.05 15K.2 23.3,18.57 25.25,16.62 25.25,12.38 23.75,10.88 22.62,10.88 21.5,12
  Bottom 0.406: v22.88,24 25.25,24 U8.10
MON_XTAL1
  Bottom 0.125: U11.17 10.88,14.5 X4.1 10.15,15.26 10.2,15.31 C33.1
MON_XTAL2
  Bottom 0.125: C34.1 8.38,11.93 X4.3 8.38,13.38 9,14 U11.16
MONITORING  (via drill 0.2)
  PowerPlane 0.125: v42.12,25.5 42.12,26.12 v39.5,28.75
  Bottom 0.125: 39.5,30.59 35.96,30.59 34.12,28.75 v30.12,28.75 | 39.5,30.59 S3.4 | U11.1 19.75,10.62 19.88,10.5 27.12,10.5 v42.12,25.5 | v39.5,28.75 39.5,30.59
N$1
  Bottom 0.305: U10.4 14,32.36 14,31.25 14.55,30.7 L2.2
  pour Bottom (no thermals): 14.5,33 14,33 14,29.25 14.25,29 15,29 15,30.5 14.5,31
N$2
  Bottom 0.125: U10.1 16.91,32.61 R29.1 18.7,31.7 R28.2
N$3
  Bottom 0.125: U9.17 1.57,35.33 1.25,35 1.25,32.5 1.75,32 C28.1
N$7
  Bottom 0.125: R30.2 19.6,36.05 R31.1 16.3,36.8 15.75,36.25 U10.8
N$8
  Bottom 0.305: U10.6 14.75,38.55 L3.1
  pour Bottom (no thermals): 14.75,36.5 14.75,39.25 14.25,39.25 14.25,38.25
N$10  (via drill 0.2)
  Top 0.125: R26.1 5.75,42.55 v5.75,37
  Bottom 0.125: v5.75,37 8.07,34.67 U9.13
N$11
  Top 0.125: R26.2 TX.2
N$13
  Top 0.125: LED3.1 R6.2
N$14
  Top 0.125: R27.2 RX.2
N$15
  Top 0.125: LED2.1 R5.2
N$16
  Bottom 0.125: R23.2 26,19.8 U8.6
N$23
  Top 0.125: LED1.1 R4.2
N$24
  Top 0.125: LED0.1 R3.2
N$25
  Top 0.125: R11.2 LED7.1
N$27
  Top 0.125: LED6.1 R10.2
N$28
  Bottom 0.125: R21.2 48.7,49.75 U7.6
N$29
  Top 0.125: LED5.1 R9.2
N$30
  Top 0.125: LED4.1 R8.2
N$32
  Bottom 0.125: U6.6 9.75,19.25 12.7,19.25 R20.2
N$38
  Bottom 0.125: J9.3 17.7,6.5 R33.1
N$39
  Bottom 0.125: J9.2 18.55,5.85 R34.1
N$41
  Top 0.125: R32.2 PWR.2
OSC_32
  Top 0.125: X3.3 21.27,42.65 U4.94
OSC_50
  Top 0.125: X2.3 37.88,28.12 36.81,27.06 U4.51
RD
  Top 0.125: U1.34 39,37.5 34,42.5 28.5,42.5 26.25,40.25 26.25,39.53 U4.84
SCL
  Bottom 0.125: 23.75,22.75 22.5,22.75 | 23.75,22.75 U8.9 | 22.5,22.75 20.25,22.75 | 20.25,22.75 18.75,21.25 16.25,21.25 12.75,17.75 | 12.75,17.75 12.75,15.5 13.25,15 U11.18 | U6.9 7.75,19.25 8.5,18.5 12.5,18.5 12.75,18.25 12.75,17.75 | 20.25,22.75 21,23.5 21,27 22.75,28.75 22.75,37.5 29.5,44.25 45,44.25 47.25,46.5 47.25,48 47,48.25 U7.9 | 22.5,22.75 22.7,22.75 R24.1 23.3,22.75 23.75,22.75
SDA  (via drill 0.2)
  Top 0.125: v13.5,17.75 v13.5,19.25 13.5,21 19.25,26.75 v21.5,26.75
  Bottom 0.125: 13.75,15.5 U11.19 13.25,15.5 13,15.75 13,17.25 v13.5,17.75 | 13.25,17.5 v13.5,17.75 | v13.5,17.75 13.75,18 | 25.25,22.25 U8.8 23.05,22.25 R25.2 20.2,22.2 18.88,20.88 16.62,20.88 v13.5,17.75 | U6.8 8.25,19.25 8.75,18.75 13,18.75 v13.5,19.25 | v21.5,26.75 23,28.25 23,37.25 29.75,44 45.25,44 47.5,46.25 47.5,48.25 47,48.75 U7.8
UCAP
  Bottom 0.125: C32.1 16.75,9.72 17.25,10.22 U11.6
USB2_VCC  (via drill 0.2)
  PowerPlane 0.305: v20.38,9.75 v16.25,9.75 16.25,8.5 15.25,7.5 v9.5,7.5
  Bottom 0.305: U11.7 16.75,10.25 v16.25,9.75 | v20.38,9.75 20,9.75 19.25,10.5 U11.2 | J9.1 3.8,5.2 3.5,5.5 3.5,8 4,8.5 8.5,8.5 v9.5,7.5
USB_VCC
  Bottom 0.305: L1.2 C26.2 | C26.2 C27.2 R18.2 | C26.2 11.75,25.95 11.75,24.75 11.38,24.38 8.12,24.38 7.75,24 U6.2
USB_VCC_RAW
  Bottom 0.305: J8.1 6,23.95 6.85,24.8 C25.1 L1.1
USBD+
  Bottom 0.125: J8.3 5.5,25.25 6.25,26 6.25,32.25 4.47,34.02 U9.15
USBD-
  Bottom 0.125: U9.16 4.33,34.67 6.5,32.5 6.5,25.5 5.88,24.88 | 5.88,24.88 5.75,24.75 | J8.2 5.6,24.6 5.88,24.88
WIRELESS_CS  (via drill 0.2)
  Top 0.125: U1.60 47,26.25 R1.2 47,25.75 v47,21.75
  Bottom 0.125: U3.8 47,20.2 v47,21.75
WIRELESS_INT  (via drill 0.2)
  Top 0.125: U1.61 47.5,26.88 48,26.38 48,5 v48.75,4.25
  Bottom 0.125: U3.4 49.23,3.77 v48.75,4.25
WIRELESS_RESET  (via drill 0.2)
  Top 0.125: v53.75,27.62 53.75,36.5 52.75,37.5 U1.15
  Bottom 0.125: U3.2 54.31,14.69 55.62,16 55.62,25.75 v53.75,27.62
WIRELESS_VCC
  Bottom 0.305: U8.2 29.5,22.75 29.75,23 34,23 35.75,24.75 39.75,24.75 41.25,26.12 45.38,26.12 47,24.5 47,23 48.5,21.5 50.5,21.5 51.45,22.45 R36.2 51.45,20.21 U3.10
WIRELESS_WAKE  (via drill 0.2)
  Top 0.125: U1.4 51.5,32 52,31.5 52,28.75 v51.5,28.25
  Bottom 0.125: U3.3 53.38,3.71 53.38,16.5 53.06,16.81 53.06,26.69 v51.5,28.25
WR
  Top 0.125: U1.33 39,38 34.25,42.75 28.25,42.75 25.77,40.27 U4.85
XTAL1
  Top 0.125: U1.24 45.5,41.12 X1.1 42.83,41.62 C36.1
XTAL2
  Top 0.125: U1.23 46,42.75 46.62,43.38 X1.3 45.3,45.58 C35.1

### Text on the board
bPlace: ES / Elastic Node / v3
tNames: MCU LEDS | UART | FPGA | LEDS
tDocu: DIP: / 0 MODE / 1 MODE / 2 LEDS / 3 MONITORING